# EAGLE board SNSP-CPU-01 (EAGLE 9.6.1), part 1 of 5
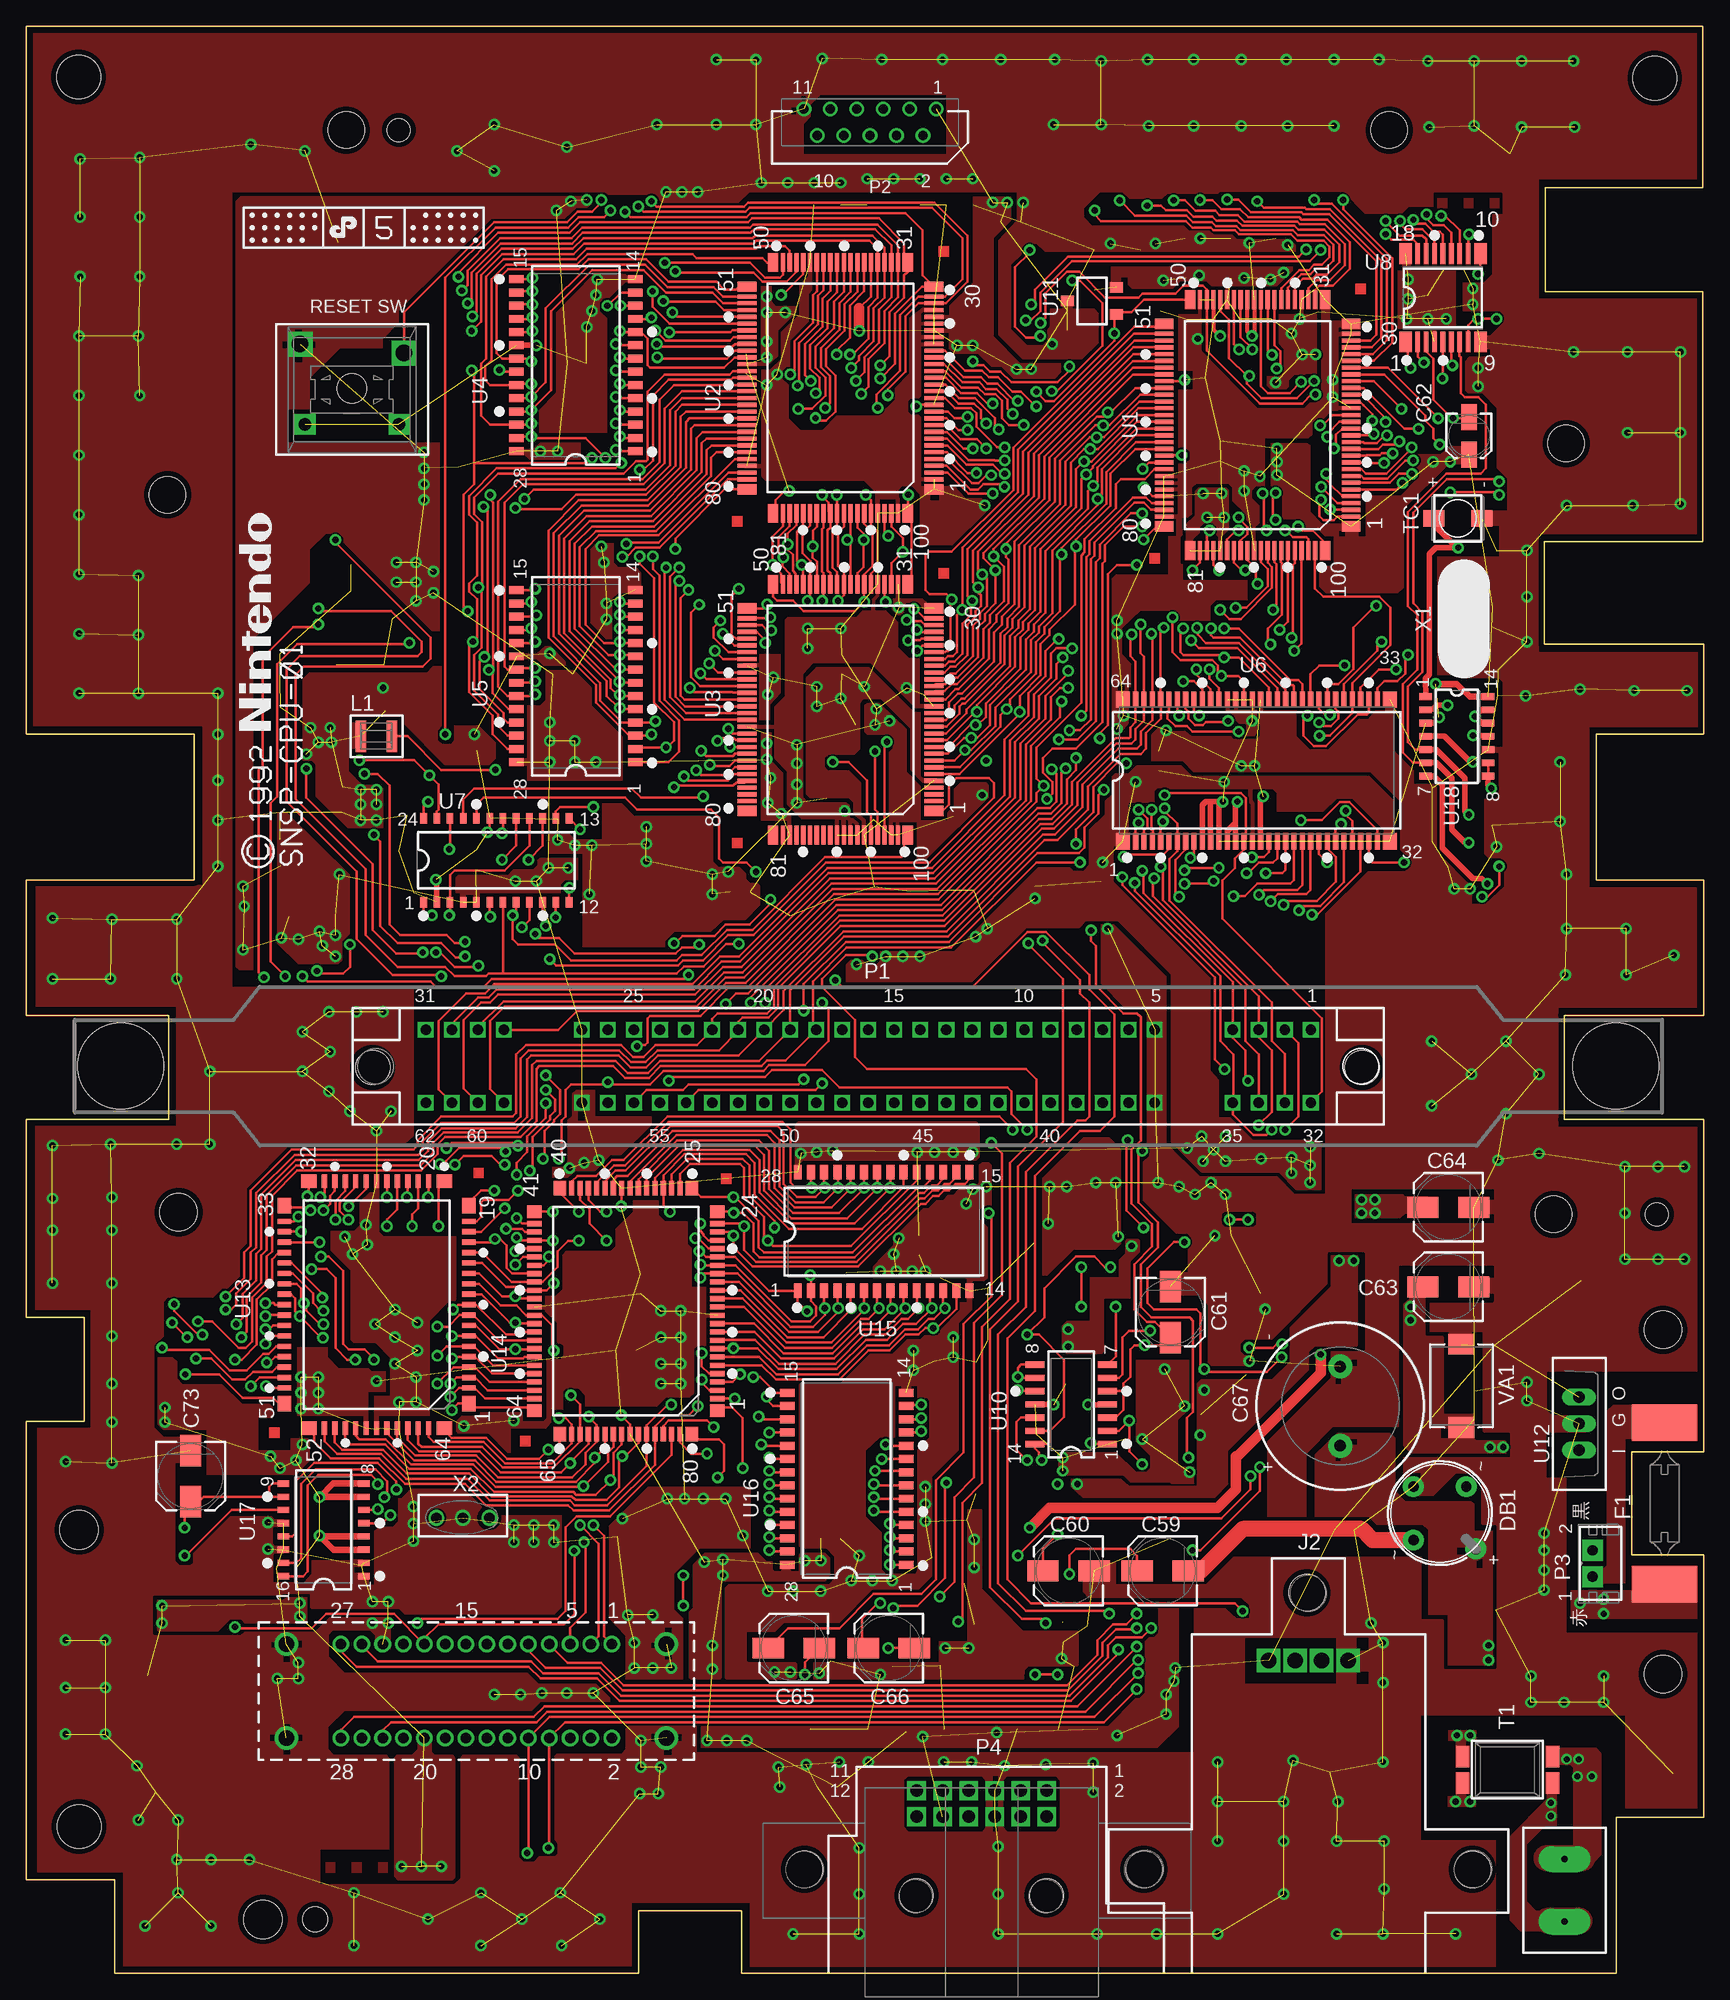
[diagram p5: board, top side]
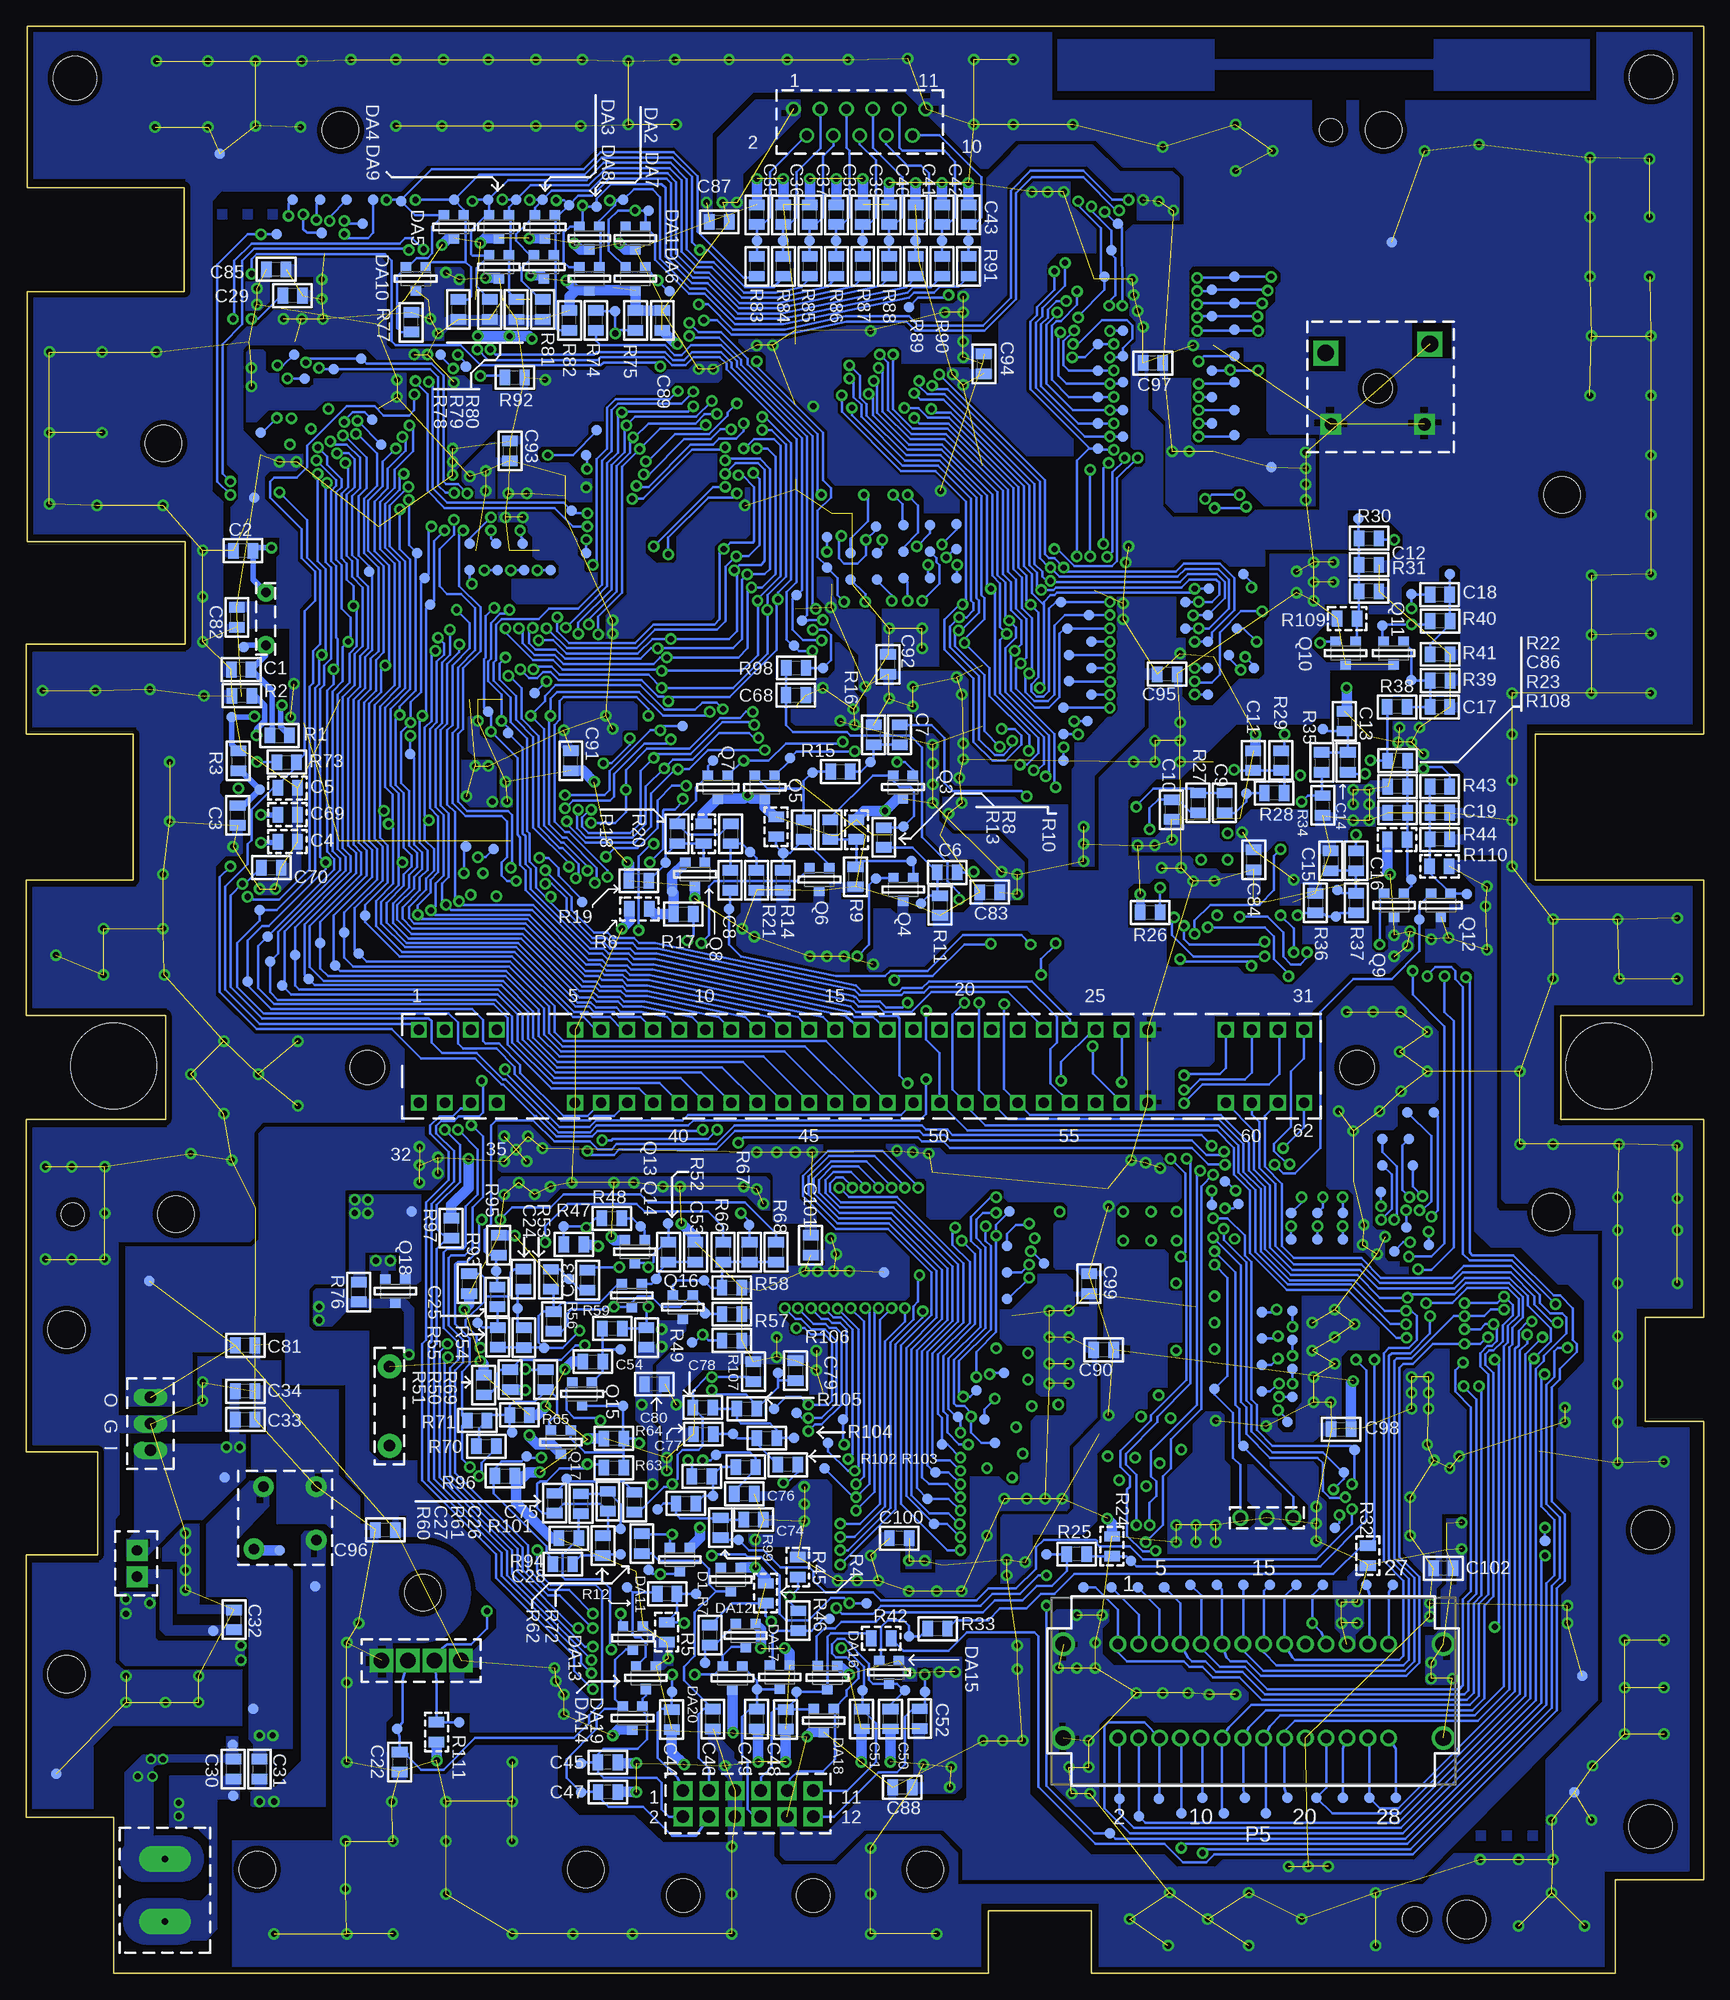
[diagram p6: board, bottom side, seen from below]

Size 161.1 x 187 mm. Coordinates in mm from the lower left corner, seen from the top.
Copper layers (1*16): Top 0.035mm / dielectric 1.5mm / Bottom 0.035mm
Design rules "default *": minimum track width 6mil, minimum drill 0.35mm, track to track 6mil, track to pad 6mil, pad to pad 6mil, via to via 6mil, smd to smd 6mil, copper to edge 20mil, drill to drill 6mil, minimum pad ring 10mil, minimum via ring 8mil, stop-mask expansion 4mil, vias tented up to drill 0mil, thermal gap 10mil
Net classes: 0 default: width 0.254 mm
tRestrict: area 23.4,22.3 to 24,22.9; area 24.7,23.6 to 25.4,23.9; area 26,22.3 to 26.5,22.9; area 24.7,21 to 25.4,21.6; area 23.6,31.3 to 24,31.8; area 24.7,29.9 to 25.3,30.5; area 26,31.3 to 26.5,31.9; area 92.8,13.6 to 93.3,14.1; area 92.8,16 to 93.3,16.6; area 92.8,18.4 to 93.3,18.9; area 127.8,31 to 128.9,32.2; area 127.8,27.8 to 128.9,29; area 125.8,56.6 to 126.3,57.4; area 127,58.3 to 127.8,58.9; area 74.4,179.9 to 74.9,180.3; area 73.5,178.5 to 73.9,179.1; area 139.3,39 to 139.8,39.8; area 137.4,40.3 to 138.2,40.9; area 86.8,141.5 to 87.7,142; area 104.8,123.2 to 105.5,123.9; area 125.8,49.2 to 126.2,49.9; area 127.1,50.8 to 127.8,51.3; area 132.9,47.4 to 133.9,48; area 135.9,51.4 to 137.1,52.3; area 53,81.9 to 53.7,82.8; area 126.1,138 to 126.6,138.5; area 25.8,157.4 to 26.5,157.9; area 24.7,156.1 to 25.2,156.7; area 25.8,154.7 to 26.5,155.3; area 27.3,156.1 to 27.8,156.7; area 60.1,22.3 to 60.5,23; area 61.2,21 to 62,21.5; area 62.6,22.3 to 63,23; area 61.4,32.6 to 62,33.2; area 60.1,31.3 to 60.6,31.8; area 61.4,30.2 to 62,30.6
bRestrict: area 89.1,102.8 to 90.5,103.4; area 61.3,21.1 to 61.9,21.7; area 60,22.3 to 60.4,22.8; area 61.3,23.5 to 61.9,24.1; area 60.1,31.4 to 60.5,31.9; area 61.2,30.1 to 61.9,30.7; area 61.3,32.5 to 61.9,33.1; area 24.4,30.1 to 25,30.8; area 23.7,37.4 to 24.3,38.2; area 25.8,39.7 to 26.3,40.3; area 55.1,59.5 to 56.1,60.3; area 58.8,58.5 to 59.6,59.6; area 59,64.1 to 60.3,64.9; area 57.7,67.5 to 58.9,68.1; area 117.4,28.3 to 119,29.3; area 126.5,28.4 to 127.3,29; area 128,29.6 to 128.4,30.5; area 126.5,31 to 127.3,31.5; area 128,41.9 to 128.6,42.6; area 124.6,42.8 to 125.3,44; area 133.2,40 to 133.7,40.7; area 138.4,45.2 to 138.9,45.8; area 132.7,47.5 to 133.4,48; area 149.2,41 to 149.8,41.7; area 91.4,59.3 to 92,60.3; area 52.1,83.5 to 52.5,83.9; area 53.1,84.4 to 53.6,84.8; area 53.1,89.5 to 53.5,89.9; area 52.1,90.5 to 52.5,90.9; area 53.1,91.4 to 53.4,91.9; area 36.9,148.6 to 37.4,149.2; area 35.5,149.9 to 36.3,150.4; area 34.2,148.5 to 34.8,149.1; area 27.9,148.6 to 28.3,149.2; area 26.5,149.9 to 27.2,150.4; area 25.2,148.7 to 25.8,149.2; area 26.5,147.3 to 27.2,147.8; area 88.1,178.4 to 88.5,178.9; area 73.5,178.6 to 74,179.4; area 74.3,180.1 to 75.1,180.6; area 99.4,55.4 to 100,55.8; area 77.1,123.7 to 77.7,124.3; area 53.7,153.3 to 54.3,153.9; area 36.3,52.9 to 36.8,53.5

## Footprints (pad centres in the part's own frame; a part is rotated, then mirrored left to right if it is on the bottom)
0805 = smd 1 x 1.5: 1 -0.95,0; 2 0.95,0
0805_EMPTY = smd 1 x 1.5: 1 -0.95,0; 2 0.95,0
CAPA_POL_SMD_6.5 = smd 3 x 2: + 2.45,0; - -2.45,0
CAPA_POL_SMD_4.3 = smd 2.5 x 1.5: + 1.8,0; - -1.8,0
CAPA_POL = drill 1.1 pad 2.3: + -3.81,0; - 3.81,0
SOT23 = smd 1 x 1: 1 -0.95,-1.1; 2 0.95,-1.1; 3 0,1.1
RECTIFIER = drill 1 pad 2: 1 3.45,-3.45; 2 -2.54,2.54; 3 -2.54,-2.6; 4 2.54,2.54
FUSE = smd 6.3 x 3.5: P$1 0,-7.75; P$2 0,7.75
TEST = smd 1 x 1: T 0,0
POWER_JACK = drill 0.6 pad 2.5 long: P$1 0,3; P$2 0,-3
RF = drill 1.5 pad 1.8 square: 1 -3.81,0; 2 -1.27,0; 3 1.27,0; 4 3.81,0
INDUCTOR = smd 1 x 3: 1 -1.5,0; 2 1.5,0
CART-SLOT = drill 1 pad 1.5 square: 1 42.5,3.5; 2 40,3.5; 3 37.5,3.5; 4 35,3.5; 5 27.5,3.5; 6 25,3.5; 7 22.5,3.5; 8 20,3.5; 9 17.5,3.5; 10 15,3.5; 11 12.5,3.5; 12 10,3.5; 13 7.5,3.5; 14 5,3.5; 15 2.5,3.5; 16 0,3.5; 17 -2.5,3.5; 18 -5,3.5; 19 -7.5,3.5; 20 -10,3.5; 21 -12.5,3.5; 22 -15,3.5; 23 -17.5,3.5; 24 -20,3.5; 25 -22.5,3.5; 26 -25,3.5; 27 -27.5,3.5; 28 -35,3.5; 29 -37.5,3.5; 30 -40,3.5; 31 -42.5,3.5; 32 42.5,-3.5; 33 40,-3.5; 34 37.5,-3.5; 35 35,-3.5; 36 27.5,-3.5; 37 25,-3.5; 38 22.5,-3.5; 39 20,-3.5; 40 17.5,-3.5; 41 15,-3.5; 42 12.5,-3.5; 43 10,-3.5; 44 7.5,-3.5; 45 5,-3.5; 46 2.5,-3.5; 47 0,-3.5; 48 -2.5,-3.5; 49 -5,-3.5; 50 -7.5,-3.5; 51 -10,-3.5; 52 -12.5,-3.5; 53 -15,-3.5; 54 -17.5,-3.5; 55 -20,-3.5; 56 -22.5,-3.5; 57 -25,-3.5; 58 -27.5,-3.5; 59 -35,-3.5; 60 -37.5,-3.5; 61 -40,-3.5; 62 -42.5,-3.5 | hole 8.255: -71.787,0; 71.787,0
CTRLS_CONNECTOR = drill 0.9 pad 1.4: 1 6.35,2.54; 2 5.08,0; 3 3.81,2.54; 4 2.54,0; 5 1.27,2.54; 6 0,0; 7 -1.27,2.54; 8 -2.54,0; 9 -3.81,2.54; 10 -5.08,0; 11 -6.35,2.54
PWR_SW = drill 1 pad 2 square: 1 -0.75,-1.27; 2 -0.75,1.27
MULTI_OUT = drill 1.2 pad 1.5 square: 1 6.25,1.25; 2 6.25,-1.25; 3 3.75,1.25; 4 3.75,-1.25; 5 1.25,1.25; 6 1.25,-1.25; 7 -1.25,1.25; 8 -1.25,-1.25; 9 -3.75,1.25; 10 -3.75,-1.25; 11 -6.25,1.25; 12 -6.25,-1.25
EXPANSION = drill 1 pad 1.6: 1 13,4.5; 2 13,-4.5; 3 11,4.5; 4 11,-4.5; 5 9,4.5; 6 9,-4.5; 7 7,4.5; 8 7,-4.5; 9 5,4.5; 10 5,-4.5; 11 3,4.5; 12 3,-4.5; 13 1,4.5; 14 1,-4.5; 15 -1,4.5; 16 -1,-4.5; 17 -3,4.5; 18 -3,-4.5; 19 -5,4.5; 20 -5,-4.5; 21 -7,4.5; 22 -7,-4.5; 23 -9,4.5; 24 -9,-4.5; 25 -11,4.5; 26 -11,-4.5; 27 -13,4.5; 28 -13,-4.5 | drill 1.5 pad 2.2: 29 -18.25,4.5; 30 -18.25,-4.5; 31 18.25,-4.5; 32 18.25,4.5
RESET_SW = drill 1.6 pad 2.2 square: 1 -5,4.37 | drill 1.6 pad 2 square: 2 5,3.5 | drill 1.2 pad 2 square: 3 -4.5,-3.35; 4 4.5,-3.35 | hole 2.8: 0,0.1; 0,0.1
TRANSF = smd 1.27 x 2.05: 1 4.32,-1.27; 2 -4.32,-1.27; 3 4.32,1.27; 4 -4.32,1.27
C-TRIMM = smd 2 x 1.6: + -2.3,0; - 2.3,0
100QFP0.65 = smd 1 x 1.8: 1 -9.725,-8.975; 30 9.725,-8.975; 51 9.725,8.975; 80 -9.725,8.975 | smd 0.4 x 1.8: 2 -8.775,-8.975; 3 -8.125,-8.975; 4 -7.475,-8.975; 5 -6.825,-8.975; 6 -6.175,-8.975; 7 -5.525,-8.975; 8 -4.875,-8.975; 9 -4.225,-8.975; 10 -3.575,-8.975; 11 -2.925,-8.975; 12 -2.275,-8.975; 13 -1.625,-8.975; 14 -0.975,-8.975; 15 -0.325,-8.975; 16 0.325,-8.975; 17 0.975,-8.975; 18 1.625,-8.975; 19 2.275,-8.975; 20 2.925,-8.975; 21 3.575,-8.975; 22 4.225,-8.975; 23 4.875,-8.975; 24 5.525,-8.975; 25 6.175,-8.975; 26 6.825,-8.975; 27 7.475,-8.975; 28 8.125,-8.975; 29 8.775,-8.975; 52 8.775,8.975; 53 8.125,8.975; 54 7.475,8.975; 55 6.825,8.975; 56 6.175,8.975; 57 5.525,8.975; 58 4.875,8.975; 59 4.225,8.975; 60 3.575,8.975; 61 2.925,8.975; 62 2.275,8.975; 63 1.625,8.975; 64 0.975,8.975; 65 0.325,8.975; 66 -0.325,8.975; 67 -0.975,8.975; 68 -1.625,8.975; 69 -2.275,8.975; 70 -2.925,8.975; 71 -3.575,8.975; 72 -4.225,8.975; 73 -4.875,8.975; 74 -5.525,8.975; 75 -6.175,8.975; 76 -6.825,8.975; 77 -7.475,8.975; 78 -8.125,8.975; 79 -8.775,8.975 | smd 1.8 x 1: 31 12.045,-6.475; 50 12.045,6.475; 81 -12.045,6.475; 100 -12.045,-6.475 | smd 1.8 x 0.4: 32 12.045,-5.525; 33 12.045,-4.875; 34 12.045,-4.225; 35 12.045,-3.575; 36 12.045,-2.925; 37 12.045,-2.275; 38 12.045,-1.625; 39 12.045,-0.975; 40 12.045,-0.325; 41 12.045,0.325; 42 12.045,0.975; 43 12.045,1.625; 44 12.045,2.275; 45 12.045,2.925; 46 12.045,3.575; 47 12.045,4.225; 48 12.045,4.875; 49 12.045,5.525; 82 -12.045,5.525; 83 -12.045,4.875; 84 -12.045,4.225; 85 -12.045,3.575; 86 -12.045,2.925; 87 -12.045,2.275; 88 -12.045,1.625; 89 -12.045,0.975; 90 -12.045,0.325; 91 -12.045,-0.325; 92 -12.045,-0.975; 93 -12.045,-1.625; 94 -12.045,-2.275; 95 -12.045,-2.925; 96 -12.045,-3.575; 97 -12.045,-4.225; 98 -12.045,-4.875; 99 -12.045,-5.525
SO28L = smd 0.762 x 1.4: 1 -8.255,-5.7; 2 -6.985,-5.7; 3 -5.715,-5.7; 4 -4.445,-5.7; 5 -3.175,-5.7; 6 -1.905,-5.7; 7 -0.635,-5.7; 8 0.635,-5.7; 9 1.905,-5.7; 10 3.175,-5.7; 11 4.445,-5.7; 12 5.715,-5.7; 13 6.985,-5.7; 14 8.255,-5.7; 15 8.255,5.7; 16 6.985,5.7; 17 5.715,5.7; 18 4.445,5.7; 19 3.175,5.7; 20 1.905,5.7; 21 0.635,5.7; 22 -0.635,5.7; 23 -1.905,5.7; 24 -3.175,5.7; 25 -4.445,5.7; 26 -5.715,5.7; 27 -6.985,5.7; 28 -8.255,5.7
SSO64 = smd 1.35 x 1.55: 1 -12.825,-6.8; 32 12.825,-6.8; 33 12.825,6.8; 64 -12.825,6.8 | smd 0.5 x 1.55: 2 -11.6,-6.8; 3 -10.8,-6.8; 4 -10,-6.8; 5 -9.2,-6.8; 6 -8.4,-6.8; 7 -7.6,-6.8; 8 -6.8,-6.8; 9 -6,-6.8; 10 -5.2,-6.8; 11 -4.4,-6.8; 12 -3.6,-6.8; 13 -2.8,-6.8; 14 -2,-6.8; 15 -1.2,-6.8; 16 -0.4,-6.8; 17 0.4,-6.8; 18 1.2,-6.8; 19 2,-6.8; 20 2.8,-6.8; 21 3.6,-6.8; 22 4.4,-6.8; 23 5.2,-6.8; 24 6,-6.8; 25 6.8,-6.8; 26 7.6,-6.8; 27 8.4,-6.8; 28 9.2,-6.8; 29 10,-6.8; 30 10.8,-6.8; 31 11.6,-6.8; 34 11.6,6.8; 35 10.8,6.8; 36 10,6.8; 37 9.2,6.8; 38 8.4,6.8; 39 7.6,6.8; 40 6.8,6.8; 41 6,6.8; 42 5.2,6.8; 43 4.4,6.8; 44 3.6,6.8; 45 2.8,6.8; 46 2,6.8; 47 1.2,6.8; 48 0.4,6.8; 49 -0.4,6.8; 50 -1.2,6.8; 51 -2,6.8; 52 -2.8,6.8; 53 -3.6,6.8; 54 -4.4,6.8; 55 -5.2,6.8; 56 -6,6.8; 57 -6.8,6.8; 58 -7.6,6.8; 59 -8.4,6.8; 60 -9.2,6.8; 61 -10,6.8; 62 -10.8,6.8; 63 -11.6,6.8
SO24 = smd 0.635 x 1: 1 -6.985,-4.025; 2 -5.715,-4.025; 3 -4.445,-4.025; 4 -3.175,-4.025; 5 -1.905,-4.025; 6 -0.635,-4.025; 7 0.635,-4.025; 8 1.905,-4.025; 9 3.175,-4.025; 10 4.445,-4.025; 11 5.715,-4.025; 12 6.985,-4.025; 13 6.985,4.025; 14 5.715,4.025; 15 4.445,4.025; 16 3.175,4.025; 17 1.905,4.025; 18 0.635,4.025; 19 -0.635,4.025; 20 -1.905,4.025; 21 -3.175,4.025; 22 -4.445,4.025; 23 -5.715,4.025; 24 -6.985,4.025
CIC = smd 1.2 x 2: 1 -3.6,-4.225; 9 3.6,-4.225; 10 3.6,4.225; 18 -3.6,4.225 | smd 0.45 x 2: 2 -2.419,-4.225; 3 -1.613,-4.225; 4 -0.806,-4.225; 5 0,-4.225; 6 0.806,-4.225; 7 1.613,-4.225; 8 2.419,-4.225; 11 2.419,4.225; 12 1.613,4.225; 13 0.806,4.225; 14 0,4.225; 15 -0.806,4.225; 16 -1.613,4.225; 17 -2.419,4.225
SO14 = smd 0.6 x 1.8: 1 -3.81,-3.475; 2 -2.54,-3.475; 3 -1.27,-3.475; 4 0,-3.475; 5 1.27,-3.475; 6 2.54,-3.475; 7 3.81,-3.475; 8 3.81,3.475; 9 2.54,3.475; 10 1.27,3.475; 11 0,3.475; 12 -1.27,3.475; 13 -2.54,3.475; 14 -3.81,3.475
PST529 = smd 1 x 1.25: 1 1.3,-2.35; 2 -1.3,-2.35; 3 0,2.35
TO220V = drill 1.1 pad 1.27 long: GND 0,0.01; I -2.54,0.01; VCC 2.54,0.01
64QFP1.00 = smd 1.5 x 1.3: 1 -9.5,-8.85; 19 9.5,-8.85; 33 9.5,8.85; 51 -9.5,8.85 | smd 0.5 x 1.3: 2 -8,-8.85; 3 -7,-8.85; 4 -6,-8.85; 5 -5,-8.85; 6 -4,-8.85; 7 -3,-8.85; 8 -2,-8.85; 9 -1,-8.85; 10 0,-8.85; 11 1,-8.85; 12 2,-8.85; 13 3,-8.85; 14 4,-8.85; 15 5,-8.85; 16 6,-8.85; 17 7,-8.85; 18 8,-8.85; 34 8,8.85; 35 7,8.85; 36 6,8.85; 37 5,8.85; 38 4,8.85; 39 3,8.85; 40 2,8.85; 41 1,8.85; 42 0,8.85; 43 -1,8.85; 44 -2,8.85; 45 -3,8.85; 46 -4,8.85; 47 -5,8.85; 48 -6,8.85; 49 -7,8.85; 50 -8,8.85 | smd 1.3 x 1.5: 20 11.85,-6.5; 32 11.85,6.5; 52 -11.85,6.5; 64 -11.85,-6.5 | smd 1.3 x 0.5: 21 11.85,-5; 22 11.85,-4; 23 11.85,-3; 24 11.85,-2; 25 11.85,-1; 26 11.85,0; 27 11.85,1; 28 11.85,2; 29 11.85,3; 30 11.85,4; 31 11.85,5; 53 -11.85,5; 54 -11.85,4; 55 -11.85,3; 56 -11.85,2; 57 -11.85,1; 58 -11.85,0; 59 -11.85,-1; 60 -11.85,-2; 61 -11.85,-3; 62 -11.85,-4; 63 -11.85,-5
80QFP0.8 = smd 1.2 x 1.4: 1 -9.55,-8.8; 24 9.55,-8.8; 41 9.55,8.8; 64 -9.55,8.8 | smd 0.5 x 1.4: 2 -8.4,-8.8; 3 -7.6,-8.8; 4 -6.8,-8.8; 5 -6,-8.8; 6 -5.2,-8.8; 7 -4.4,-8.8; 8 -3.6,-8.8; 9 -2.8,-8.8; 10 -2,-8.8; 11 -1.2,-8.8; 12 -0.4,-8.8; 13 0.4,-8.8; 14 1.2,-8.8; 15 2,-8.8; 16 2.8,-8.8; 17 3.6,-8.8; 18 4.4,-8.8; 19 5.2,-8.8; 20 6,-8.8; 21 6.8,-8.8; 22 7.6,-8.8; 23 8.4,-8.8; 42 8.4,8.8; 43 7.6,8.8; 44 6.8,8.8; 45 6,8.8; 46 5.2,8.8; 47 4.4,8.8; 48 3.6,8.8; 49 2.8,8.8; 50 2,8.8; 51 1.2,8.8; 52 0.4,8.8; 53 -0.4,8.8; 54 -1.2,8.8; 55 -2,8.8; 56 -2.8,8.8; 57 -3.6,8.8; 58 -4.4,8.8; 59 -5.2,8.8; 60 -6,8.8; 61 -6.8,8.8; 62 -7.6,8.8; 63 -8.4,8.8 | smd 1.4 x 1.2: 25 11.8,-6.35; 40 11.8,6.35; 65 -11.8,6.35; 80 -11.8,-6.35 | smd 1.4 x 0.5: 26 11.8,-5.2; 27 11.8,-4.4; 28 11.8,-3.6; 29 11.8,-2.8; 30 11.8,-2; 31 11.8,-1.2; 32 11.8,-0.4; 33 11.8,0.4; 34 11.8,1.2; 35 11.8,2; 36 11.8,2.8; 37 11.8,3.6; 38 11.8,4.4; 39 11.8,5.2; 66 -11.8,5.2; 67 -11.8,4.4; 68 -11.8,3.6; 69 -11.8,2.8; 70 -11.8,2; 71 -11.8,1.2; 72 -11.8,0.4; 73 -11.8,-0.4; 74 -11.8,-1.2; 75 -11.8,-2; 76 -11.8,-2.8; 77 -11.8,-3.6; 78 -11.8,-4.4; 79 -11.8,-5.2
SO28W = smd 0.762 x 1.4: 1 -8.255,-5.7; 2 -6.985,-5.7; 3 -5.715,-5.7; 4 -4.445,-5.7; 5 -3.175,-5.7; 6 -1.905,-5.7; 7 -0.635,-5.7; 8 0.635,-5.7; 9 1.905,-5.7; 10 3.175,-5.7; 11 4.445,-5.7; 12 5.715,-5.7; 13 6.985,-5.7; 14 8.255,-5.7; 15 8.255,5.7; 16 6.985,5.7; 17 5.715,5.7; 18 4.445,5.7; 19 3.175,5.7; 20 1.905,5.7; 21 0.635,5.7; 22 -0.635,5.7; 23 -1.905,5.7; 24 -3.175,5.7; 25 -4.445,5.7; 26 -5.715,5.7; 27 -6.985,5.7; 28 -8.255,5.7
SO16 = smd 0.6 x 1.1: 1 -4.445,-3.875; 2 -3.175,-3.875; 3 -1.905,-3.875; 4 -0.635,-3.875; 5 0.635,-3.875; 6 1.905,-3.875; 7 3.175,-3.875; 8 4.445,-3.875; 9 4.445,3.875; 10 3.175,3.875; 11 1.905,3.875; 12 0.635,3.875; 13 -0.635,3.875; 14 -1.905,3.875; 15 -3.175,3.875; 16 -4.445,3.875
SO14L = smd 0.65 x 1.2: 1 -3.81,-3; 2 -2.54,-3; 3 -1.27,-3; 4 0,-3; 5 1.27,-3; 6 2.54,-3; 7 3.81,-3; 8 3.81,3; 9 2.54,3; 10 1.27,3; 11 0,3; 12 -1.27,3; 13 -2.54,3; 14 -3.81,3
MB_OUTLINE = hole 3.7: 22.75,5.2; 5.1,42.6 | hole 2.4: 27.75,5.2 | hole 3.5: 74.75,10; 107.35,10; 138.9,10; 123,36.55; 13.6,142; 30.75,177; 146.7,72.9; 147.9,146.9; 130.9,177 | hole 3.2: 85.5,7.5; 98,7.5 | hole 4.2: 5.1,14.1; 5.05,182.1; 156.4,182 | hole 3.6: 14.65,73.1; 157.2,28.75; 157.2,61.8 | hole 3.3: 33.3,87; 128.3,87 | hole 2.2: 35.8,177; 156.6,72.9
VARISTOR = smd 2 x 2.5: 1 -4,0; 2 4,0
XTAL_MAIN = drill 0.9 pad 1.778: P$1 -2.54,0; P$2 2.54,0
XTAL_S-DSP = drill 1 pad 1.5: P$1 -2.54,0; P$2 2.54,0

## Placement (x,y rotation side)
C1  47pF  [0805]  140.44,125.2 180 bottom
C2  15pF  [0805]  140.25,136.61 180 bottom
C3  56nF  [0805]  140.77,111.2 90 bottom
C4  EMPTY_0805  [0805_EMPTY]  135.98,108.68 0 bottom
C5  EMPTY_0805  [0805_EMPTY]  135.98,113.84 0 bottom
C6  100nF  [0805]  72.63,105.73 0 bottom
C7  100nF  [0805]  77.21,118.93 90 bottom
C8  100nF  [0805]  93.48,104.97 270 bottom
C9  1nF  [0805]  46.01,112.4 270 bottom
C10  82pF  [0805]  51.1,111.76 270 bottom
C11  1µF  [0805]  43.25,116.47 90 bottom
C12  10pF  [0805]  32.14,135.27 0 bottom
C13  220pF  [0805]  34.49,120.25 270 bottom
C14  1µF  [0805]  34.17,116.29 90 bottom
C15  220pF  [0805]  35.81,106.84 270 bottom
C16  1µF  [0805]  33.38,106.84 270 bottom
C17  10pF  [0805]  25.34,121.62 0 bottom
C18  1µF  [0805]  25.34,132.41 180 bottom
C19  10pF  [0805]  25.34,111.48 0 bottom
C22  330pF  [0805]  125.22,20.3 270 bottom
C23  1µF  [0805]  107.19,66.58 270 bottom
C24  1µF  [0805]  113.36,66.67 270 bottom
C25  1µF  [0805]  115.85,64.96 270 bottom
C26  1µF  [0805]  102.68,45.25 90 bottom
C27  1µF  [0805]  107.81,45.1 90 bottom
C28  1µF  [0805]  109.57,39.31 0 bottom
C29  100nF  [0805]  135.5,161.11 180 bottom
C30  10nF  [0805]  141.2,19.63 270 bottom
C31  10nF  [0805]  138.69,19.63 270 bottom
C32  100nF  [0805]  141.13,33.96 270 bottom
C33  100nF  [0805]  140.05,53.19 180 bottom
C34  100nF  [0805]  140.05,55.91 180 bottom
C35  330pF  [0805]  90.91,168.88 90 bottom
C36  330pF  [0805]  88.37,168.88 90 bottom
C37  330pF  [0805]  85.83,168.88 90 bottom
C38  330pF  [0805]  83.29,168.88 90 bottom
C39  330pF  [0805]  80.75,168.88 90 bottom
C40  330pF  [0805]  78.21,168.88 90 bottom
C41  330pF  [0805]  75.67,168.88 90 bottom
C42  330pF  [0805]  73.13,168.88 90 bottom
C43  330pF  [0805]  70.59,168.88 90 bottom
C44  47pF  [0805]  99.1,24.39 90 bottom
C45  47pF  [0805]  105.23,20.28 180 bottom
C46  300pF  [0805]  95.15,24.42 90 bottom
C47  47pF  [0805]  105.22,17.42 180 bottom
C48  47pF  [0805]  88.15,24.4 90 bottom
C49  47pF  [0805]  90.94,24.44 90 bottom
C50  47pF  [0805]  78.09,24.44 90 bottom
C51  300pF  [0805]  80.86,24.44 90 bottom
C52  300pF  [0805]  75.28,24.46 90 bottom
C53  1µF  [0805]  96.82,69.27 270 bottom
C54  1µF  [0805]  106.67,58.75 0 bottom
C59  10µF 50V  [CAPA_POL_SMD_6.5]  109.14,38.66 180 top
C60  10µF 50V  [CAPA_POL_SMD_6.5]  100.11,38.66 180 top
C61  10µF 50V  [CAPA_POL_SMD_6.5]  109.9,63.5 270 top
C62  2.2µF  [CAPA_POL_SMD_4.3]  138.56,147.64 270 top
C63  33µF 25V  [CAPA_POL_SMD_6.5]  136.58,65.94 180 top
C64  33µF 25V  [CAPA_POL_SMD_6.5]  136.58,73.57 180 top
C65  10µF 50V  [CAPA_POL_SMD_6.5]  73.73,31.25 180 top
C66  10µF 50V  [CAPA_POL_SMD_6.5]  82.85,31.25 180 top
C67  2200µF 25V  [CAPA_POL]  126.2,54.48 90 top
C68  56pF  [0805]  87.17,122.76 0 bottom
C69  EMPTY_0805  [0805_EMPTY]  135.98,111.27 0 bottom
C70  82pF  [0805]  137.55,106.19 0 bottom
C73  47µF 16V  [CAPA_POL_SMD_6.5]  15.8,47.75 270 top
C74  1nF  [0805]  91.24,43.58 180 bottom
C75  1.8nF  [0805]  96.21,47.73 180 bottom
C76  100pF  [0805]  92.13,46.05 180 bottom
C77  1nF  [0805]  96.05,51.79 0 bottom
C78  1.8nF  [0805]  96.12,54.34 180 bottom
C79  100pF  [0805]  87.21,57.88 270 bottom
C80  100nF  [0805]  100.75,56.59 180 bottom
C81  1µF  [0805]  140.05,60.31 180 bottom
C82  100nF  [0805]  140.85,130.22 270 bottom
C83  100nF  [0805]  68.56,103.83 0 bottom
C84  1µF  [0805]  43.2,106.93 90 bottom
C85  100nF  [0805]  137.08,163.64 180 bottom
C86  10pF  [0805]  29.4,113.97 180 bottom
C87  100nF  [0805]  94.53,168.19 0 bottom
C88  100nF  [0805]  76.94,17.88 180 bottom
C89  100nF  [0805]  100,158.74 270 bottom
C90  100nF  [0805]  57.61,59.88 180 bottom
C91  100nF  [0805]  108.78,116.44 90 bottom
C92  100nF  [0805]  78.33,125.7 90 bottom
C93  100nF  [0805]  114.63,146.2 270 bottom
C94  100nF  [0805]  69.12,154.55 270 bottom
C95  100nF  [0805]  51.53,124.76 180 bottom
C96  100µF  [0805]  126.6,42.58 180 bottom
C97  100nF  [0805]  52.89,154.64 180 bottom
C98  100nF  [0805]  34.82,52.26 0 bottom
C99  100nF  [0805]  59.02,66.23 90 bottom
C100  100nF  [0805]  77.23,41.8 180 bottom
C101  100nF  [0805]  85.76,69.94 270 bottom
C102  100nF  [0805]  25,38.91 180 bottom
D1  12V_ZENER  [SOT23]  93.43,37.81 180 bottom
DA1  DAP202  [SOT23]  102.58,166.63 180 bottom
DA2  DAP202  [SOT23]  107.01,166.63 180 bottom
DA3  DAP202  [SOT23]  111.28,167.72 180 bottom
DA4  DAP202  [SOT23]  115.68,167.72 180 bottom
DA5  DAP202  [SOT23]  120.03,167.72 180 bottom
DA6  DAN202  [SOT23]  102.58,162.73 180 bottom
DA7  DAN202  [SOT23]  107.01,162.73 180 bottom
DA8  DAN202  [SOT23]  111.37,163.87 180 bottom
DA9  DAN202  [SOT23]  115.68,163.87 180 bottom
DA10  DAN202  [SOT23]  123.68,162.73 180 bottom
DA11  DAN217  [SOT23]  98.32,39.73 180 bottom
DA12  DAN202  [SOT23]  92,32.44 180 bottom
DA13  DAN202  [SOT23]  102.82,32.21 180 bottom
DA14  DAN202  [SOT23]  101.57,28.39 180 bottom
DA15  DAN202  [SOT23]  78.23,28.92 180 bottom
DA16  DAN202  [SOT23]  84.14,28.41 180 bottom
DA17  DAN202  [SOT23]  88.73,28.47 180 bottom
DA18  DAN202  [SOT23]  84.5,24.28 180 bottom
DA19  DAN202  [SOT23]  102.86,24.52 180 bottom
DA20  DAN202  [SOT23]  93.26,28.37 180 bottom
DB1  RECTIFIER  [RECTIFIER]  135.77,44.21 0 top
E1  EMPTY_0805  [0805_EMPTY]  81.36,109.84 90 bottom
E2  EMPTY_0805  [0805_EMPTY]  89.07,110.12 90 bottom
E3  EMPTY_0805  [0805_EMPTY]  96.04,109.45 90 bottom
F1  1.5A  [FUSE]  157.35,45.14 180 top
G1  TEST  [TEST]  149.29,66.5 0 bottom
G2  TEST  [TEST]  158.18,19.15 0 bottom
G3  TEST  [TEST]  142.03,47.65 0 bottom
G4  TEST  [TEST]  143.11,32.9 0 bottom
G5  TEST  [TEST]  141.26,21.97 0 bottom
G6  TEST  [TEST]  141.21,17.08 0 bottom
G7  TEST  [TEST]  139.28,25.39 0 bottom
G8  TEST  [TEST]  133.32,37.17 0 bottom
G9  TEST  [TEST]  136.74,40.62 0 bottom
G10  TEST  [TEST]  107.81,17.4 90 bottom
G11  TEST  [TEST]  107.81,20.19 0 bottom
G12  TEST  [TEST]  99.05,27.05 0 bottom
G13  TEST  [TEST]  74.8,27.05 0 bottom
G14  TEST  [TEST]  76.7,27.18 0 bottom
G15  TEST  [TEST]  80.76,27.18 0 bottom
G16  TEST  [TEST]  87.11,27.05 0 bottom
G17  TEST  [TEST]  90.92,27.3 0 bottom
G18  TEST  [TEST]  83.94,34.04 0 bottom
G19  TEST  [TEST]  95.88,29.84 0 bottom
G20  TEST  [TEST]  76.32,32.38 0 bottom
G21  TEST  [TEST]  103.37,37.08 0 bottom
G22  TEST  [TEST]  96.77,36.45 0 bottom
G23  TEST  [TEST]  101.34,38.73 0 bottom
G24  TEST  [TEST]  113.02,49.66 0 bottom
G25  TEST  [TEST]  103.75,54.48 0 bottom
G26  TEST  [TEST]  125.47,23.5 0 bottom
G27  TEST  [TEST]  54.98,39.62 0 bottom
G28  TEST  [TEST]  63.11,40.26 0 bottom
G29  TEST  [TEST]  100.45,44.58 0 bottom
G30  TEST  [TEST]  95.11,45.85 0 bottom
G31  TEST  [TEST]  92.7,41.66 0 bottom
G32  TEST  [TEST]  114.42,51.94 0 bottom
G33  TEST  [TEST]  104,42.67 0 bottom
G34  TEST  [TEST]  104,40.26 0 bottom
G35  TEST  [TEST]  104,59.94 0 bottom
G36  TEST  [TEST]  111.37,60.07 0 bottom
G37  TEST  [TEST]  95.88,63.37 0 bottom
G38  TEST  [TEST]  100.58,66.67 0 bottom
G39  TEST  [TEST]  96,66.55 0 bottom
G40  TEST  [TEST]  91.69,71.88 0 bottom
G41  TEST  [TEST]  99.43,72.01 0 bottom
G42  TEST  [TEST]  102.1,71.75 0 bottom
G43  TEST  [TEST]  109.47,71.75 0 bottom
G44  TEST  [TEST]  108.96,66.67 0 bottom
G45  TEST  [TEST]  97.15,60.58 0 bottom
G46  TEST  [TEST]  93.21,51.82 0 bottom
G47  TEST  [TEST]  94.86,49.78 180 bottom
G48  TEST  [TEST]  87.37,51.44 0 bottom
G49  TEST  [TEST]  88.89,57.66 0 bottom
G50  TEST  [TEST]  117.72,62.48 0 bottom
G51  TEST  [TEST]  113.91,63.88 0 bottom
G52  TEST  [TEST]  115.94,67.44 0 bottom
G53  TEST  [TEST]  109.21,47.5 0 bottom
G54  TEST  [TEST]  119.5,24.13 0 bottom
G55  TEST  [TEST]  46.73,37.34 0 bottom
G56  TEST  [TEST]  44.19,37.34 0 bottom
G57  TEST  [TEST]  41.65,37.34 0 bottom
G58  TEST  [TEST]  39.11,37.34 0 bottom
G59  TEST  [TEST]  36.57,37.34 0 bottom
G60  TEST  [TEST]  32.38,37.34 0 bottom
G61  TEST  [TEST]  29.84,37.34 0 bottom
G62  TEST  [TEST]  49.27,37.34 0 bottom
G63  TEST  [TEST]  51.81,37.08 0 bottom
G64  TEST  [TEST]  54.35,37.08 0 bottom
G65  TEST  [TEST]  56.89,37.08 0 bottom
G66  TEST  [TEST]  59.55,37.08 0 bottom
G67  TEST  [TEST]  46.09,15.37 0 bottom
G68  TEST  [TEST]  44.06,16.89 0 bottom
G69  TEST  [TEST]  42.03,15.37 0 bottom
G70  TEST  [TEST]  40,16.89 0 bottom
G71  TEST  [TEST]  29.58,16.89 0 bottom
G72  TEST  [TEST]  34.66,16.89 0 bottom
G73  TEST  [TEST]  32.12,16.89 0 bottom
G74  TEST  [TEST]  37.2,16.89 0 bottom
G75  TEST  [TEST]  54.22,15.11 0 bottom
G76  TEST  [TEST]  56.13,16.76 0 bottom
G77  TEST  [TEST]  52.32,16.76 0 bottom
G78  TEST  [TEST]  50.16,15.37 0 bottom
G79  TEST  [TEST]  48.12,16.89 0 bottom
G80  TEST  [TEST]  27.3,101.22 0 bottom
G81  TEST  [TEST]  22.73,103.63 0 bottom
G82  TEST  [TEST]  28.06,105.03 0 bottom
G83  TEST  [TEST]  24.38,134.37 0 bottom
G84  TEST  [TEST]  28.06,132.46 0 bottom
G85  TEST  [TEST]  30.85,129.41 0 bottom
G86  TEST  [TEST]  33.14,139.7 0 bottom
G87  TEST  [TEST]  28.06,124.21 0 bottom
G88  TEST  [TEST]  36.57,119.51 0 bottom
G89  TEST  [TEST]  43.93,113.28 0 bottom
G90  TEST  [TEST]  35.3,101.47 0 bottom
G91  TEST  [TEST]  35.17,104.01 0 bottom
G92  TEST  [TEST]  91.56,107.7 0 bottom
G93  TEST  [TEST]  93.59,102.23 0 bottom
G94  TEST  [TEST]  88.38,107.57 0 bottom
G95  TEST  [TEST]  79.49,105.16 0 bottom
G96  TEST  [TEST]  76.06,106.81 0 bottom
G97  TEST  [TEST]  75.18,102.74 0 bottom
G98  TEST  [TEST]  76.83,110.11 0 bottom
G99  TEST  [TEST]  80,116.33 0 bottom
G100  TEST  [TEST]  85.59,115.32 0 bottom
G101  TEST  [TEST]  87.75,116.71 0 bottom
G102  TEST  [TEST]  95.11,116.46 0 bottom
G103  TEST  [TEST]  99.69,106.68 0 bottom
G104  TEST  [TEST]  99.05,103.89 0 bottom
G105  TEST  [TEST]  84.57,125.35 0 bottom
G106  TEST  [TEST]  88.38,166.37 180 bottom
G107  TEST  [TEST]  83.3,166.37 0 bottom
G108  TEST  [TEST]  78.22,166.37 180 bottom
G109  TEST  [TEST]  73.14,166.37 0 bottom
G110  TEST  [TEST]  90.92,166.37 0 bottom
G111  TEST  [TEST]  85.84,166.37 0 bottom
G112  TEST  [TEST]  80.76,166.37 0 bottom
G113  TEST  [TEST]  75.68,166.37 0 bottom
G114  TEST  [TEST]  70.6,166.37 0 bottom
G115  TEST  [TEST]  125.09,170.18 0 bottom
G116  TEST  [TEST]  120.01,170.31 0 bottom
G117  TEST  [TEST]  116.7,170.31 0 bottom
G118  TEST  [TEST]  114.04,170.31 0 bottom
G119  TEST  [TEST]  111.5,170.31 0 bottom
G120  TEST  [TEST]  108.96,169.8 0 bottom
G121  TEST  [TEST]  106.29,169.67 0 bottom
G122  TEST  [TEST]  103.75,170.31 0 bottom
G123  TEST  [TEST]  101.34,169.29 0 bottom
G124  TEST  [TEST]  99.31,161.54 0 bottom
G125  TEST  [TEST]  104.51,159.64 0 bottom
G126  TEST  [TEST]  86.61,129.92 0 bottom
G127  TEST  [TEST]  140.2,127.38 0 bottom
G128  TEST  [TEST]  138.68,113.67 0 bottom
G129  TEST  [TEST]  141.34,120.65 0 bottom
G130  TEST  [TEST]  46.98,56.13 0 bottom
G131  TEST  [TEST]  44.19,50.67 0 bottom
G132  TEST  [TEST]  128.52,101.6 0 bottom
G133  TEST  [TEST]  123.56,136.4 0 bottom
G134  TEST  [TEST]  122.8,133.99 0 bottom
G135  TEST  [TEST]  124.2,117.09 0 bottom
G136  TEST  [TEST]  122.29,131.44 0 bottom
G137  TEST  [TEST]  114.8,119.13 0 bottom
G138  TEST  [TEST]  138.68,102.11 0 bottom
G139  TEST  [TEST]  139.82,95.25 0 bottom
G140  TEST  [TEST]  137.91,99.57 0 bottom
G141  TEST  [TEST]  137.66,97.16 0 bottom
G142  TEST  [TEST]  136.52,94.87 0 bottom
G143  TEST  [TEST]  135.25,97.79 0 bottom
G144  TEST  [TEST]  133.98,95.5 0 bottom
G145  TEST  [TEST]  128.13,134.62 0 bottom
G146  TEST  [TEST]  132.83,98.93 0 bottom
G147  TEST  [TEST]  131.44,96.77 0 bottom
G148  TEST  [TEST]  130.55,99.95 0 bottom
G149  TEST  [TEST]  129.15,97.92 0 bottom
G150  TEST  [TEST]  12.44,17.4 0 bottom
G151  TEST  [TEST]  29.96,166.24 0 bottom
G152  TEST  [TEST]  116.7,121.16 0 bottom
G153  TEST  [TEST]  137.03,167 0 bottom
G154  TEST  [TEST]  135.5,170.31 0 bottom
G155  TEST  [TEST]  132.71,167.13 0 bottom
G156  TEST  [TEST]  132.83,170.31 0 bottom
G157  TEST  [TEST]  130.29,170.31 0 bottom
G158  TEST  [TEST]  128.77,168.02 0 bottom
G159  TEST  [TEST]  127.75,170.31 0 bottom
G160  TEST  [TEST]  84.19,135 0 bottom
G161  TEST  [TEST]  135.37,155.45 0 bottom
G162  TEST  [TEST]  134.36,153.16 0 bottom
G163  TEST  [TEST]  128.9,155.07 0 bottom
G164  TEST  [TEST]  131.56,154.05 0 bottom
G165  TEST  [TEST]  138.55,147.96 0 bottom
G166  TEST  [TEST]  57.02,13.46 0 bottom
G167  TEST  [TEST]  15.23,41.53 0 bottom
G168  TEST  [TEST]  73.91,43.18 0 bottom
G169  TEST  [TEST]  74.54,45.59 0 bottom
G170  TEST  [TEST]  73.78,48.13 0 bottom
G171  TEST  [TEST]  71.62,53.47 0 bottom
G172  TEST  [TEST]  73.14,50.8 0 bottom
G173  TEST  [TEST]  33.52,50.29 0 bottom
G174  TEST  [TEST]  34.54,48.13 0 bottom
G175  TEST  [TEST]  42.41,63.5 0 bottom
G176  TEST  [TEST]  39.49,63.63 0 bottom
G177  TEST  [TEST]  42.41,60.96 0 bottom
G178  TEST  [TEST]  39.49,60.83 0 bottom
G179  TEST  [TEST]  42.41,58.42 0 bottom
G180  TEST  [TEST]  39.49,58.04 0 bottom
G181  TEST  [TEST]  42.41,55.88 0 bottom
G182  TEST  [TEST]  39.49,55.37 0 bottom
G183  TEST  [TEST]  40,52.96 0 bottom
G184  TEST  [TEST]  69.08,53.21 0 bottom
G185  TEST  [TEST]  67.17,57.66 0 bottom
G186  TEST  [TEST]  89.27,54.23 0 bottom
G187  TEST  [TEST]  87.11,53.85 0 bottom
G188  TEST  [TEST]  82.67,53.21 0 bottom
G189  TEST  [TEST]  84.07,50.93 0 bottom
G190  TEST  [TEST]  84.45,48.51 0 bottom
G191  TEST  [TEST]  66.92,64.77 0 bottom
G192  TEST  [TEST]  66.92,67.31 0 bottom
G193  TEST  [TEST]  63.37,68.2 0 bottom
G194  TEST  [TEST]  66.92,69.85 0 bottom
G195  TEST  [TEST]  66.67,73.15 0 bottom
G196  TEST  [TEST]  69.84,56.01 0 bottom
G197  TEST  [TEST]  68.06,50.93 0 bottom
G198  TEST  [TEST]  78.73,67.31 0 bottom
G199  TEST  [TEST]  80.38,35.56 0 bottom
G200  TEST  [TEST]  35.42,42.8 0 bottom
G201  TEST  [TEST]  26.41,69.98 0 bottom
G202  TEST  [TEST]  29.71,69.34 0 bottom
G203  TEST  [TEST]  25.9,82.68 0 bottom
G204  TEST  [TEST]  28.44,82.68 0 bottom
G205  TEST  [TEST]  27.93,77.6 0 bottom
G206  TEST  [TEST]  28.31,80.14 0 bottom
G207  TEST  [TEST]  28.57,71.63 0 bottom
G208  TEST  [TEST]  30.85,80.14 0 bottom
G209  TEST  [TEST]  30.85,77.6 0 bottom
G210  TEST  [TEST]  30.98,75.06 0 bottom
G211  TEST  [TEST]  34.66,73.03 0 bottom
G212  TEST  [TEST]  34.66,70.48 0 bottom
G213  TEST  [TEST]  37.08,73.03 0 bottom
G214  TEST  [TEST]  37.08,70.48 0 bottom
G215  TEST  [TEST]  39.62,73.03 0 bottom
G216  TEST  [TEST]  39.62,70.48 0 bottom
G217  TEST  [TEST]  45.97,76.07 0 bottom
G218  TEST  [TEST]  47.24,73.79 0 bottom
G219  TEST  [TEST]  44.7,73.91 0 bottom
G220  TEST  [TEST]  11.68,28.57 180 bottom
G221  TEST  [TEST]  108.7,140.46 0 bottom
G222  TEST  [TEST]  98.04,119.76 0 bottom
G223  TEST  [TEST]  142.49,174.75 0 bottom
G224  TEST  [TEST]  139.18,141.73 0 bottom
G225  TEST  [TEST]  41.52,144.65 0 bottom
G226  TEST  [TEST]  124.07,73.15 0 bottom
G227  TEST  [TEST]  107.69,102.87 0 bottom
G228  TEST  [TEST]  116.2,107.95 180 bottom
G229  TEST  [TEST]  118.86,108.2 0 bottom
G230  TEST  [TEST]  112.26,122.94 0 bottom
G231  TEST  [TEST]  107.31,136.4 0 bottom
G232  TEST  [TEST]  110.74,134.75 180 bottom
G233  TEST  [TEST]  113.4,137.29 180 bottom
G234  TEST  [TEST]  113.28,134.75 180 bottom
G235  TEST  [TEST]  115.94,137.29 180 bottom
G236  TEST  [TEST]  115.82,134.75 180 bottom
G237  TEST  [TEST]  118.48,137.29 180 bottom
G238  TEST  [TEST]  118.48,134.75 180 bottom
G239  TEST  [TEST]  127.88,149.22 0 bottom
G240  TEST  [TEST]  126.99,146.81 0 bottom
G241  TEST  [TEST]  118.86,154.31 180 bottom
G242  TEST  [TEST]  121.28,155.45 180 bottom
G243  TEST  [TEST]  106.29,148.21 0 bottom
G244  TEST  [TEST]  107.31,145.8 0 bottom
G245  TEST  [TEST]  87.11,132.33 0 bottom
G246  TEST  [TEST]  87.37,127.51 0 bottom
G247  TEST  [TEST]  45.08,157.86 0 bottom
G248  TEST  [TEST]  47.24,159.13 0 bottom
G249  TEST  [TEST]  45.08,160.4 0 bottom
G250  TEST  [TEST]  47.24,161.67 0 bottom
G251  TEST  [TEST]  45.08,162.94 0 bottom
G252  TEST  [TEST]  56.25,168.02 0 bottom
G253  TEST  [TEST]  56.89,165.48 0 bottom
G254  TEST  [TEST]  57.52,162.94 0 bottom
G255  TEST  [TEST]  47.62,127.89 0 bottom
G256  TEST  [TEST]  49.78,129.16 0 bottom
G257  TEST  [TEST]  47.62,130.43 0 bottom
G258  TEST  [TEST]  49.78,131.7 0 bottom
G259  TEST  [TEST]  47.49,132.97 0 bottom
G260  TEST  [TEST]  61.71,131.7 0 bottom
G261  TEST  [TEST]  59.05,130.43 0 bottom
G262  TEST  [TEST]  61.08,129.16 0 bottom
G263  TEST  [TEST]  81.91,133.86 0 bottom
G264  TEST  [TEST]  71.75,133.99 0 bottom
G265  TEST  [TEST]  71.75,136.78 0 bottom
G266  TEST  [TEST]  71.75,139.19 0 bottom
G267  TEST  [TEST]  74.29,133.99 0 bottom
G268  TEST  [TEST]  74.29,136.53 0 bottom
G269  TEST  [TEST]  74.29,139.06 0 bottom
G270  TEST  [TEST]  76.83,133.99 0 bottom
G271  TEST  [TEST]  76.83,136.53 0 bottom
G272  TEST  [TEST]  76.83,139.06 0 bottom
G273  TEST  [TEST]  79.37,133.86 0 bottom
G274  TEST  [TEST]  79.37,136.4 0 bottom
G275  TEST  [TEST]  79.49,138.94 0 bottom
G276  TEST  [TEST]  81.91,136.4 0 bottom
G277  TEST  [TEST]  84.19,137.92 0 bottom
G278  TEST  [TEST]  47.24,148.84 0 bottom
G279  TEST  [TEST]  45.08,147.7 180 bottom
G280  TEST  [TEST]  45.08,150.11 180 bottom
G281  TEST  [TEST]  47.24,151.38 180 bottom
G282  TEST  [TEST]  45.08,152.78 180 bottom
G283  TEST  [TEST]  47.24,153.92 180 bottom
G284  TEST  [TEST]  45.08,155.32 180 bottom
G285  TEST  [TEST]  44.82,129.16 0 bottom
G286  TEST  [TEST]  58.79,127.89 0 bottom
G287  TEST  [TEST]  60.95,126.62 0 bottom
G288  TEST  [TEST]  58.79,125.35 0 bottom
G289  TEST  [TEST]  60.95,124.08 0 bottom
G290  TEST  [TEST]  58.79,122.81 0 bottom
G291  TEST  [TEST]  61.46,121.54 0 bottom
G292  TEST  [TEST]  59.17,120.27 0 bottom
G293  TEST  [TEST]  61.46,119 0 bottom
G294  TEST  [TEST]  61.46,116.46 0 bottom
G295  TEST  [TEST]  58.16,146.43 0 bottom
G296  TEST  [TEST]  76.32,160.02 0 bottom
G297  TEST  [TEST]  55.74,147.57 180 bottom
G298  TEST  [TEST]  58.16,148.84 180 bottom
G299  TEST  [TEST]  55.74,150.11 180 bottom
G300  TEST  [TEST]  58.16,151.38 180 bottom
G301  TEST  [TEST]  55.74,152.78 180 bottom
G302  TEST  [TEST]  58.16,153.92 180 bottom
G303  TEST  [TEST]  55.74,155.32 180 bottom
G304  TEST  [TEST]  58.16,156.46 180 bottom
G305  TEST  [TEST]  55.74,157.73 180 bottom
G306  TEST  [TEST]  47.62,122.81 0 bottom
G307  TEST  [TEST]  47.62,125.35 0 bottom
G308  TEST  [TEST]  43.17,125.35 0 bottom
G309  TEST  [TEST]  45.59,126.62 0 bottom
G310  TEST  [TEST]  44.19,134.37 0 bottom
J1  POWER_JACK  [POWER_JACK]  147.75,7.98 0 top
J2  RF_MODULATOR  [RF]  123.15,30.05 0 top
L1  22µH  [INDUCTOR]  33.65,118.8 0 top
P1  CART-SLOT  [CART-SLOT]  80.88,87.12 0 top
P2  CTRLS_CONNECTOR  [CTRLS_CONNECTOR]  81.05,176.5 0 top
P3  PWR_SW  [PWR_SW]  151.18,39.36 0 top
P4  MULTI_OUT  [MULTI_OUT]  91.77,16.3 0 top
P5  EXPANSION  [EXPANSION]  43.25,27.12 0 top
Q3  B852K  [SOT23]  76.89,113.92 180 bottom
Q4  C2412K  [SOT23]  76.85,104.09 180 bottom
Q5  B852K  [SOT23]  90.17,113.91 180 bottom
Q6  C2412K  [SOT23]  84.91,105.04 180 bottom
Q7  B852K  [SOT23]  94.67,113.91 180 bottom
Q8  C2412K  [SOT23]  96.86,105.54 180 bottom
Q9  C2412K  [SOT23]  29.74,102.58 180 bottom
Q10  C2412K  [SOT23]  34.38,126.79 180 bottom
Q11  C2412K  [SOT23]  29.78,126.79 180 bottom
Q12  C2412K  [SOT23]  25.24,102.58 180 bottom
Q13  C2412K  [SOT23]  102.64,69.31 180 bottom
Q14  C2412K  [SOT23]  102.92,65.1 180 bottom
Q15  C2412K  [SOT23]  107.7,55.65 180 bottom
Q16  C2412K  [SOT23]  98.03,63.99 180 bottom
Q17  C2412K  [SOT23]  109.75,51.03 180 bottom
Q18  C2412  [SOT23]  125.63,65.51 180 bottom
R1  270  [0805]  136.75,118.88 0 bottom
R2  5.1k  [0805]  140.37,122.7 180 bottom
R3  27  [0805]  140.71,116.44 270 bottom
R4  EMPTY_0805  [0805_EMPTY]  90.07,36.51 90 bottom
R5  EMPTY_0805  [0805_EMPTY]  99.58,32.77 270 bottom
R6  EMPTY_0805  [0805_EMPTY]  102.21,102.22 180 bottom
R7  30  [0805]  95.43,32.49 270 bottom
R8  1.1k  [0805]  83.88,109.84 270 bottom
R9  1.5k  [0805]  81.45,105.32 270 bottom
R10  10k  [0805]  78.74,109.08 270 bottom
R11  120  [0805]  73.34,102.55 270 bottom
R12  30  [0805]  99.54,36.45 180 bottom
R13  1.1k  [0805]  86.42,109.84 270 bottom
R14  1.5k  [0805]  88.42,104.97 270 bottom
R15  10k  [0805]  82.89,115.41 0 bottom
R16  120  [0805]  79.7,118.93 90 bottom
R17  30  [0805]  97.97,101.73 0 bottom
R18  1.1k  [0805]  98.57,109.45 270 bottom
R19  1.5k  [0805]  102.25,104.92 180 bottom
R20  10k  [0805]  93.44,109.45 270 bottom
R21  120  [0805]  90.96,104.97 270 bottom
R22  470  [0805]  29.4,116.46 180 bottom
R23  10k  [0805]  29.4,111.47 0 bottom
R24  EMPTY_0805  [0805_EMPTY]  56.81,41.02 90 bottom
R25  22  [0805]  60.2,40.27 180 bottom
R26  1.8k  [0805]  53.15,101.89 0 bottom
R27  390  [0805]  48.55,112.4 90 bottom
R28  3.3k  [0805]  41.23,113.35 180 bottom
R29  3.3k  [0805]  40.59,116.47 270 bottom
R30  470  [0805]  32.14,137.81 0 bottom
R31  10k  [0805]  32.14,132.73 180 bottom
R32  EMPTY_0805  [0805_EMPTY]  32.25,40.13 270 bottom
R33  22  [0805]  73.57,33.1 180 bottom
R34  1k  [0805]  36.58,112.16 90 bottom
R35  270  [0805]  36.67,116.29 270 bottom
R36  1k  [0805]  37.29,102.79 270 bottom
R37  270  [0805]  33.37,102.79 270 bottom
R38  470  [0805]  29.44,121.62 180 bottom
R39  10k  [0805]  25.32,124.15 180 bottom
R40  39  [0805]  25.32,129.86 180 bottom
R41  39  [0805]  25.32,126.67 180 bottom
R42  EMPTY_0805  [0805_EMPTY]  78.98,32.18 0 bottom
R43  470  [0805]  25.34,113.97 0 bottom
R44  10k  [0805]  25.34,108.9 180 bottom
R45  EMPTY_0805  [0805_EMPTY]  86.99,39.03 90 bottom
R46  39  [0805]  86.95,33.87 270 bottom
R47  EMPTY_0805  [0805_EMPTY]  108.49,70 180 bottom
R48  33k  [0805]  104.84,72.52 0 bottom
R49  1k  [0805]  101.52,61.07 90 bottom
R50  33k  [0805]  114.61,57.01 90 bottom
R51  33k  [0805]  117.15,56.51 90 bottom
R52  1k  [0805]  99.41,69.27 270 bottom
R53  10k  [0805]  110.72,66.65 270 bottom
R54  10k  [0805]  113.3,61.06 270 bottom
R55  10k  [0805]  115.8,61.08 270 bottom
R56  24k  [0805]  110.44,62.61 270 bottom
R57  1.8k  [0805]  93.31,63.31 0 bottom
R58  1k  [0805]  93.31,65.85 0 bottom
R59  1k  [0805]  104.8,61.92 180 bottom
R60  10k  [0805]  110.35,45.15 270 bottom
R61  10k  [0805]  105.23,45.34 270 bottom
R62  10k  [0805]  105.7,41.09 90 bottom
R63  24k  [0805]  104.65,48.56 0 bottom
R64  1.8k  [0805]  104.65,51.37 180 bottom
R65  1k  [0805]  113.71,53.63 0 bottom
R66  10k  [0805]  94.16,69.27 90 bottom
R67  100  [0805]  91.62,69.27 90 bottom
R68  47k  [0805]  89.08,69.27 90 bottom
R69  10k  [0805]  111.21,57.01 90 bottom
R70  100  [0805]  116.9,50.62 0 bottom
R71  47k  [0805]  117.78,53.09 180 bottom
R72  1k  [0805]  101.97,41.27 270 bottom
R73  0  [0805]  136.07,116.31 0 bottom
R74  2.2k  [0805]  106.38,158.74 90 bottom
R75  100k  [0805]  102.58,158.74 90 bottom
R76  1.8k  [0805]  129.15,65.44 90 bottom
R77  10k  [0805]  124.11,158.56 90 bottom
R78  10k  [0805]  119.58,159.78 270 bottom
R79  10k  [0805]  116.57,159.78 270 bottom
R80  10k  [0805]  114.03,159.78 270 bottom
R81  10k  [0805]  111.49,159.78 270 bottom
R82  10k  [0805]  108.92,158.74 90 bottom
R83  100  [0805]  90.91,163.93 270 bottom
R84  100  [0805]  88.37,163.93 90 bottom
R85  100  [0805]  85.83,163.93 270 bottom
R86  100  [0805]  83.29,163.93 90 bottom
R87  100  [0805]  80.75,163.93 270 bottom
R88  100  [0805]  78.21,163.93 90 bottom
R89  100  [0805]  75.67,163.93 270 bottom
R90  100  [0805]  73.13,163.93 90 bottom
R91  100  [0805]  70.59,163.93 270 bottom
R92  10k  [0805]  114.17,153.26 0 bottom
R93  200  [0805]  118.55,66.23 270 bottom
R94  200  [0805]  108.97,41.8 180 bottom
R95  200  [0805]  115.71,69.94 90 bottom
R96  200  [0805]  115.11,47.78 0 bottom
R97  10k  [0805]  120.26,71.57 90 bottom
R98  100  [0805]  87.15,125.37 0 bottom
R99  22k  [0805]  94.41,42.8 90 bottom
R101  22k  [0805]  97.73,45.13 0 bottom
R102  22k  [0805]  92,48.63 0 bottom
R103  22k  [0805]  87.95,48.85 180 bottom
R104  22k  [0805]  89.97,51.4 0 bottom
R105  22k  [0805]  91.88,54.23 0 bottom
R106  5.1k  [0805]  93.31,60.77 0 bottom
R107  5.1k  [0805]  91.25,57.78 90 bottom
R108  EMPTY_0805  [0805_EMPTY]  29.43,108.88 0 bottom
R109  EMPTY_0805  [0805_EMPTY]  34.24,130.1 0 bottom
R110  EMPTY_0805  [0805_EMPTY]  25.38,106.32 180 bottom
R111  EMPTY_0805  [0805_EMPTY]  121.69,23.17 270 bottom
RESETSW  RESET_SW  [RESET_SW]  31.3,152.1 0 top
T1  TDK zjys-2  [TRANSF]  142.26,19.57 0 top
TC1  20pF  [C-TRIMM]  137.5,139.72 0 top
U1  S-CPU(5A22)  [100QFP0.65]  118.26,148.67 90 top
U2  S-PPU1(5C77)  [100QFP0.65]  78.21,152.25 90 top
U3  S-PPU2(5C78)  [100QFP0.65]  78.21,121.35 90 top
U4  PPU_SRAM  [SO28L]  52.79,154.43 90 top
U5  PPU_SRAM  [SO28L]  52.79,124.57 90 top
U6  S-WRAM  [SSO64]  118.15,115.52 0 top
U7  S-ENC  [SO24]  45.16,106.9 0 top
U8  CIC  [CIC]  136.06,160.9 0 top
U10  LM324  [SO14]  100.36,54.65 90 top
U11  PST529  [PST529]  102.37,160.6 90 top
U12  7805  [TO220V]  149.15,52.78 90 top
U13  S-SMP  [64QFP1.00]  33.66,64.22 90 top
U14  S-DSP  [80QFP0.8]  57.6,63.6 90 top
U15  APU_SRAM  [SO28W]  82.36,71.25 0 top
U16  APU_SRAM  [SO28W]  78.81,47.5 90 top
U17  UPD6376  [SO16]  28.59,42.6 90 top
U18  S-CLK  [SO14L]  137.4,118.8 270 top
U$2  [MB_OUTLINE]  0,0 0 top
VA1  ERZC050K220  [VARISTOR]  137.84,56.42 90 top
X1  17.734MHz  [XTAL_MAIN]  138.08,130.08 90 top
X2  24.576MHz  [XTAL_S-DSP]  41.95,43.75 180 top

## Tracks (layer width: path | path; a pad name or v marks a point on that pad's centre or on a via)
4.433M  (via drill 0.6 pad 1.1)
  Top 0.254: U18.5 133.41,117.53 132.71,118.24 132.71,123.57 134.1,124.97 134.1,130.68 133.22,131.57 133.22,140.27 136.46,143.51 141.22,143.51 v141.47,143.26 | v124.33,165.48 123.28,164.44 100.42,164.44 97.4,161.42 97.4,159.64 96.51,158.75 v96,158.75 | v56.13,169.29 55.49,168.66 53.08,168.66 52.06,167.64 45.08,167.64 40.25,162.81 v40.25,119
  Top 0.508: U18.5 135.45,117.53 138.17,114.81 138.17,111.63 v138.55,111.25
  Bottom 0.254: R29.1 40.25,117.76 v40.25,119 | v141.47,143.26 142.23,144.02 142.23,156.46 140.33,158.37 140.33,164.47 139.18,165.61 124.45,165.61 v124.33,165.48 | v96,158.75 94.73,158.75 93.34,157.35 88.13,157.35 82.29,158.62 76.57,158.62 75.68,157.73 69.08,157.73 66.03,160.78 66.03,170.94 64.51,172.47 59.55,172.47 56.38,169.29 v56.13,169.29
  Bottom 0.508: v138.55,111.25 136.95,111.25 C69.1
4016.D0  (via drill 0.6 pad 1.1)
  Top 0.254: U1.32 123.78,161.64 124.2,162.05 125.47,162.05 127.12,163.7 127.12,166.24 124.96,168.4 122.49,168.4 122.26,168.63 117.37,168.63 116.58,169.42 114.8,169.42 113.92,170.29 v112.73,170.29
  Bottom 0.254: G119.T 112.23,169.57 DA3.2 114.04,167.01 114.04,166.37 112.64,164.97 DA8.2 113.53,163.76 113.53,162.56 111.7,160.73 R81.1 | G119.T 112.72,170.31 v112.73,170.29 | G119.T 110.61,171.2 106.97,171.2 105.32,172.85 99.51,172.85 98.67,172 98.67,165.14 96.85,163.32 95.49,163.32 92.57,160.4 88.89,160.4 88.38,160.5 81.57,162 80.75,162.96 R87.2
4016.D1  (via drill 0.6 pad 1.1)
  Top 0.254: v110.19,170.26 111.29,170.26 112.3,169.25 114.21,169.25 114.6,168.86 116.38,168.86 117.01,168.22 122.09,168.22 122.34,167.97 124.73,167.97 126.64,166.07 126.64,164.04 125.21,162.61 123.94,162.61 123.14,161.81 U1.33
  Bottom 0.254: R82.1 110.03,157.79 110.23,157.99 110.23,164.78 DA8.1 110.23,165.16 110.23,168.72 DA3.1 109.94,168.82 G120.T | G120.T 109.42,170.26 v110.19,170.26 | G120.T 108.07,170.69 106.76,170.69 105.11,172.34 99.6,172.34 99.18,171.92 99.18,164.93 97.06,162.81 95.58,162.81 92.66,159.89 88.77,159.89 78.99,162.05 78.21,162.83 R88.1
4017.D0  (via drill 0.6 pad 1.1)
  Top 0.254: U1.27 129.21,156.15 130.17,157.1 130.17,164.47 125.21,169.42 122.93,169.42 122.8,169.54 118.86,169.54 v118.23,170.18
  Bottom 0.254: R79.1 117.85,162.01 117.85,163.75 DA9.2 118.23,164.97 118.36,165.1 118.36,167.39 116.92,168.82 DA4.2 116.63,170.23 G117.T | G117.T 118.1,170.31 v118.23,170.18 | G117.T 114.8,172.21 107.27,172.21 105.62,173.86 99.22,173.86 97.66,172.3 97.66,165.56 96.43,164.34 95.07,164.34 92.15,161.42 89.15,161.42 88.65,161.49 88.35,161.54 86.63,161.92 85.83,162.83 R85.2
4017.D1  (via drill 0.6 pad 1.1)
  Top 0.254: v115.35,170.35 116.41,170.35 117.62,169.14 122.44,169.14 122.67,168.91 125.15,168.91 129.66,164.4 129.66,157.35 129.1,156.79 U1.28
  Bottom 0.254: R80.1 114.73,161.43 DA9.1 114.55,165.15 114.55,168.64 DA4.1 114.73,169.62 G118.T | G118.T 115.31,170.31 v115.35,170.35 | G118.T 112.64,171.7 107.06,171.7 105.41,173.35 99.3,173.35 98.16,172.22 98.16,165.35 96.64,163.83 95.28,163.83 92.36,160.91 89.02,160.91 88.25,161.05 84.1,161.96 R86.1
!5MIN  (via drill 0.6 pad 1.1)
  Top 0.254: U3.38 79.83,134.45 80.44,135.06 v80.44,137.67 80.44,138.24 79.83,138.85 U2.93 | v82.8,138.05 82.44,138.41 U2.97
  Bottom 0.254: v82.8,138.05 83.05,137.79 83.05,135.89 82.54,135.38 81.27,135.38 80.44,136.21 v80.44,137.67 79.49,138.62 G275.T
!5MOUT  (via drill 0.6 pad 1.1)
  Top 0.254: v16.94,61.34 16.5,61.34 14.22,63.63 v14.22,64.26 | v26.54,95.76 27.04,95.25 38.85,95.25 39.36,94.74 43.93,94.74 44.7,95.5 63.24,95.5 v63.62,95.89 | v62.22,98.93 62.35,98.93 63.05,99.64 66.1,99.64 67.17,100.71 69.46,100.71 71.49,102.74 v71.49,103.12
  Bottom 0.254: v16.94,61.34 16.94,60.52 17.64,59.82 17.64,26.86 29.14,15.37 35.68,15.37 G74.T 36.25,17.84 P5.22 | R98.1 88.1,122.78 C68.1 88.12,119.88 87.45,119.21 82.28,119.21 81.94,118.87 76.19,118.87 75.06,117.74 75.06,109.1 72.64,106.68 72.64,104.9 72.34,104.6 72.33,104.6 71.49,103.76 v71.49,103.12 | v14.22,64.26 18.41,68.45 22.47,68.45 23.11,69.09 23.11,94.74 23.87,95.5 23.87,96.27 24.25,96.65 25.77,96.65 26.54,95.89 v26.54,95.76 | v63.62,95.89 63.62,97.41 62.22,98.81 v62.22,98.93
!BURST  (via drill 0.6 pad 1.1)
  Top 0.254: U3.1 88,111.62 88.64,112.27 88.64,114.05 89.36,114.77 92.49,114.77 92.96,114.3 92.96,112.9 86.73,106.68 76.83,106.68 69.84,99.69 67.43,99.69 65.02,97.28 63.11,97.28 62.6,96.77 50.92,96.77 v50.28,97.41 | v43.43,96.77 43.3,96.65 41.14,96.65 39.74,98.04 v39.36,98.04 | v40.63,101.6 40.72,101.68 U7.3 40.72,105.49 41.14,105.92 45.97,105.92 48.34,108.29 U7.16
  Bottom 0.254: v50.28,97.41 50.03,97.16 43.81,97.16 v43.43,96.77 | v39.36,98.04 39.36,100.33 v40.63,101.6
!CPURD  (via drill 0.6 pad 1.1)
  Top 0.254: v115.44,120.27 115.31,120.14 113.28,120.14 113.02,119.89 112.26,119.89 111.62,120.52 111.62,121.19 111.35,121.46 U6.57 | v114.67,130.94 115.56,130.05 116.64,130.05 119.65,133.06 119.65,135.04 119.23,135.46 U1.92
  Bottom 0.254: P1.23 63.38,90.82 66.79,94.23 74.16,94.23 76.06,92.33 78.73,92.33 79.24,92.84 81.14,92.84 81.65,93.34 100.7,97.41 102.73,97.41 103.24,97.92 105.15,97.92 105.66,98.42 106.93,98.42 112.64,104.14 112.64,106.05 113.15,106.55 113.15,109.22 113.4,109.47 113.4,117.73 G137.T 114.8,119.63 v115.44,120.27 115.44,122.81 116.7,124.08 116.7,125.98 116.45,126.24 116.45,129.67 115.56,130.56 115.05,130.56 v114.67,130.94
!CPUWR  (via drill 0.6 pad 1.1)
  Top 0.254: P1.54 64.6,84.84 75.81,84.84 v76.45,85.47 | v116.15,131.14 117.16,131.14 119.25,133.22 119.25,134.87 118.58,135.53 U1.91 | v116.45,119.25 112.01,119.25 111.5,119.76 110.36,119.76 109.59,120.52 109.59,121.16 109.75,121.31 U6.59
  Bottom 0.254: v76.45,85.47 77.21,86.23 77.21,91.69 77.44,91.92 79.09,91.92 79.49,92.33 81.4,92.33 81.91,92.84 100.83,96.9 102.86,96.9 103.37,97.41 105.28,97.41 105.78,97.92 107.05,97.92 113.15,104.01 113.15,105.92 113.66,106.43 113.66,109.09 113.91,109.35 113.91,116.71 v116.45,119.25 116.45,120.9 G152.T 117.11,121.56 117.11,126.21 116.96,126.36 116.96,130.33 v116.15,131.14
!CSYNC  (via drill 0.6 pad 1.1)
  Top 0.254: U7.8 47.06,101.94 v46.73,101.6 46.73,99.31 47.24,98.81 50.79,98.81 52.32,97.28 62.48,97.28 62.98,97.79 64.89,97.79 67.3,100.2 69.75,100.2 76.73,107.19 84.07,107.19 84.32,107.44 84.32,108.94 U3.100
!HCLD  (via drill 0.6 pad 1.1)
  Top 0.254: U3.39 79.19,137.34 v78.86,137.67 79.19,137.99 U2.92
  Bottom 0.254: v78.86,137.67 78.86,136.91 G274.T
!IRQ  (via drill 0.6 pad 1.1)
  Top 0.254: v16.5,62.61 17.9,62.61 20.44,60.07 21.07,60.07 21.71,60.71 21.71,64.9 23.11,66.29 23.11,68.83 23.61,69.34 23.61,74.68 26.03,77.09 37.94,77.09 39.53,78.69 39.53,79.61 40.26,80.33 47.49,80.33 49.01,81.86 49.01,86.87 49.27,87.12 56.38,87.12 57.52,85.98 59.81,85.98 60.95,87.12 70.6,87.12 71.14,87.66 72.92,87.66 P1.18 75.56,90.94 75.56,95.25 78.8,98.49 88.83,98.49 97.02,106.68 v101.21,106.68 | v98.04,112.78 98.54,113.28 98.54,114.43 97.66,115.32 97.66,116.71 98.54,117.6 100.83,117.6 103.37,120.14 103.37,135.38 103.62,135.64 103.62,137.16 105.4,138.94 v107.18,138.94 | v123.69,152.91 122.04,151.26 118.61,151.26 117.21,152.65 117.21,153.16 v117.47,153.42 117.21,153.42 115.5,155.13 115.5,158.81 114.69,159.63 U1.46
  Bottom 0.254: 32.18,16.95 G73.T | G73.T 31.11,15.88 29.33,15.88 18.13,27.08 18.13,59.97 17.77,60.33 17.77,61.72 16.88,62.61 v16.5,62.61 | R92.1 115.28,153.42 v117.47,153.42 | G73.T 32.12,22.49 P5.26 | v101.21,106.68 99.94,107.95 99.94,111.63 99.81,111.76 98.8,111.76 98.04,112.52 v98.04,112.78 | v107.18,138.94 108.58,138.94 110.36,140.72 120.9,140.72 122.55,142.37 122.55,151.64 123.69,152.78 v123.69,152.91
!MUTE  (via drill 0.6 pad 1.1)
  Top 0.254: v107.31,71.63 105.66,73.28 105.66,79.88 v105.78,80.01 | v94.73,81.03 93.46,82.3 61.59,82.3 57.4,78.11 56.25,78.11 54.73,76.58 52.95,76.58 52.4,76.03 U14.39
  Bottom 0.254: R48.1 106.42,72.52 v107.31,71.63 107.43,71.75 G43.T 109.47,69.95 R47.2 | v105.78,80.01 104.89,80.01 104.77,80.14 95.62,80.14 v94.73,81.03
!OVER  (via drill 0.6 pad 1.1)
  Top 0.254: U3.50 71.73,132.22 72.13,131.83 73.65,131.83 74.67,130.81 79.62,130.81 v80.51,131.7 80.48,131.72 U3.37 80.48,134.34 81.27,135.13 81.27,138.43 80.48,139.22 U2.94
  Bottom 0.254: v80.51,131.7 80.51,132.46 G263.T
!PARD  (via drill 0.6 pad 1.1)
  Top 0.254: v117.34,85.72 117.09,85.98 117.09,88.65 115.88,89.85 P1.4 115.88,95.19 107.31,103.76 107.31,105.79 v107.19,105.9 | v106.8,28.83 102.61,24.64 50.27,24.64 P5.10 48.25,11.68 v48.12,11.56 | v13.07,60.07 13.26,59.88 17.58,59.88 19.55,57.91 21.17,57.91 22.76,59.5 23.3,59.5 24.02,60.22 U13.46 | v112.64,120.78 112.15,121.27 U6.56 | U3.7 89.69,115.83 93.59,119.73 93.59,120.83 v94.18,121.41 94.48,121.72 94.48,122.31 97,124.82 97,127.86 97.78,128.65 97.78,129.29 99.31,130.81 99.31,136.14 v99.43,136.27 99.43,136.85 103.73,141.14 103.73,144.19 106.58,147.04 U1.68 | v92.83,142.12 92.8,142.09 90.5,142.09 88.46,144.12 U2.3
  Bottom 0.254: G79.T 48.12,22.57 P5.10 | v117.34,85.72 117.21,85.6 117.21,82.68 117.59,82.3 119.56,82.3 120,81.86 121.24,81.86 121.72,81.37 121.72,80.68 120.01,78.96 120.01,76.07 122.17,73.91 122.17,60.71 122.42,60.45 122.42,47.37 115.44,40.39 115.44,38.16 107.81,30.54 107.81,29.84 v106.8,28.83 | v48.12,11.56 47.74,11.94 28.19,11.94 14.6,25.53 14.6,37.21 13.84,37.97 13.84,43.81 15.11,45.09 15.11,56.52 14.34,57.28 14.34,59.75 14.02,60.07 v13.07,60.07 | v107.19,105.9 107.19,106.31 109.47,108.58 109.72,108.58 111.37,110.24 111.37,119.51 v112.64,120.78 111.24,122.17 111.24,122.68 110.23,123.7 102.13,123.7 99.78,121.34 96.83,121.34 96.13,122.05 94.81,122.05 v94.18,121.41 | v99.43,136.27 99.43,137.85 95.56,141.73 93.22,141.73 v92.83,142.12
!PAWR  (via drill 0.6 pad 1.1)
  Top 0.254: U13.47 23.91,59.22 23.36,58.67 v23.11,58.67 | P5.9 48.25,30.99 49.9,29.34 55.11,29.34 57.27,27.18 100.07,27.18 103.37,30.48 103.37,31.75 104.64,33.02 106.55,33.02 v106.67,33.15 | v119.63,81.03 119.12,80.52 117.85,80.52 115.88,82.49 P1.35 115.94,83.68 115.94,88.27 114.67,89.53 114.67,95.76 106.48,103.95 v106.48,104.72 | v110.74,120.78 110.55,120.96 U6.58 | U3.6 89.64,115.17 95.43,120.96 v95.43,121.16 95.43,122.68 97.4,124.65 97.4,127.64 98.29,128.52 98.29,129.03 100.7,131.44 100.7,136.91 v100.83,137.03 100.83,137.67 104.13,140.97 104.13,144.02 106.51,146.4 U1.69 | v93.96,142.76 93.72,143 91.94,143 91.43,142.49 90.67,142.49 88.39,144.78 U2.4
  Bottom 0.254: v23.11,58.67 23.87,57.91 23.87,55.88 22.34,54.36 22.34,36.7 23.11,35.94 23.11,27.69 23.49,27.3 41.9,27.3 44.06,29.46 46.47,29.46 48.25,31.24 P5.9 48.25,36.32 G62.T | v106.67,33.15 109.85,36.32 110.99,36.32 113.4,38.73 113.4,40.89 120.39,47.88 120.39,58.17 119.63,58.93 119.63,60.61 121.02,62.01 121.02,69.22 120.64,69.6 119.12,69.6 118.86,69.85 118.86,73.66 117.72,74.8 117.72,79.12 v119.63,81.03 | v106.48,104.72 106.29,104.9 106.29,106.17 109.21,109.09 109.59,109.09 110.86,110.36 110.86,120.65 v110.74,120.78 110.74,122.43 110.1,123.06 102.23,123.06 99.94,120.78 95.81,120.78 v95.43,121.16 | v100.83,137.03 95.11,142.75 93.97,142.75 v93.96,142.76
!RAMSEL  (via drill 0.6 pad 1.1)
  Top 0.254: P1.32 124.45,84.69 124.45,91.69 114.87,101.28 114.87,104.97 116.07,106.17 116.07,107.06 116.95,107.94 U6.15 117.15,108.92 117.15,112.87 116.67,113.35 109.53,113.35 v109.34,113.16 | v100.19,119.38 101.21,119.38 102.25,120.42 102.25,135.79 102.61,136.14 102.61,137.41 106.42,141.22 107.34,141.22 108.02,140.54 U1.78
  Bottom 0.254: v109.34,113.16 105.53,113.16 105.05,113.64 105.05,115.48 101.14,119.38 v100.19,119.38 99.81,119.76 G222.T
!RESET  (via drill 0.6 pad 1.1)
  Top 0.254: U8.10 139.66,163.42 v139.44,163.19 | v100.19,154.31 100.19,153.92 99.05,152.78 94.61,152.78 93.59,153.8 92.58,153.8 91.94,154.43 91.31,154.43 v90.92,154.81 | v82.54,131.7 82.44,131.81 U3.34
  Bottom 0.254: v139.44,163.19 139.44,164.59 138.93,165.1 126.61,165.1 125.98,164.47 125.98,156.72 125.59,156.34 119.37,156.34 117.47,154.43 105.91,154.43 105.66,154.69 100.58,154.69 v100.19,154.31 | v90.92,154.81 90.92,154.31 84.57,147.96 84.57,143.38 83.81,142.62 83.81,141.73 85.08,140.46 85.08,136.02 84.19,135.13 G160.T 83.18,133.99 83.18,132.33 v82.54,131.7
!RESOUT0  (via drill 0.6 pad 1.1)
  Top 0.254: U3.33 83.08,135.42 v84.19,136.53 84.19,137.82 83.08,138.93 U2.98
  Bottom 0.254: v84.19,136.53 G277.T
!RESOUT1  (via drill 0.6 pad 1.1)
  Top 0.254: v51.17,78.23 51.43,78.49 51.43,81.92 51.81,82.3 51.81,84.84 52.32,85.34 55.62,85.34 v55.87,85.6 56.13,85.34 59.91,85.34 61.24,86.68 70.8,86.68 71.37,87.25 74.8,87.25 77.08,89.53 77.08,92.58 v76.45,93.22 | v50.2,68.83 50.2,68.5 49.7,68 U14.47 | v52.64,40.58 52.7,40.52 52.7,34.54 51.68,33.53 39.62,33.53 38.25,32.16 P5.19 35.33,34.54 28.82,34.54 27.42,33.15 20.18,33.15 v20.06,33.27 | v20.06,58.93 20.69,58.93 22.15,60.38 22.15,64.72 23.61,66.18 23.61,68.58 24.25,69.22 U13.37 | U6.8 111.35,107.93 110.36,106.93 110.36,103.77 v110.72,103.4 | v97.02,151.89 97.91,151 98.73,151 104.51,156.78 v104.51,157.48 104.51,159.09 U11.2 104.93,159.51 106.16,159.51 107.37,160.72 U1.50